# EAGLE design hamilton-thermostat-main (EAGLE 8.1.0)

## Sheet 1 of 4
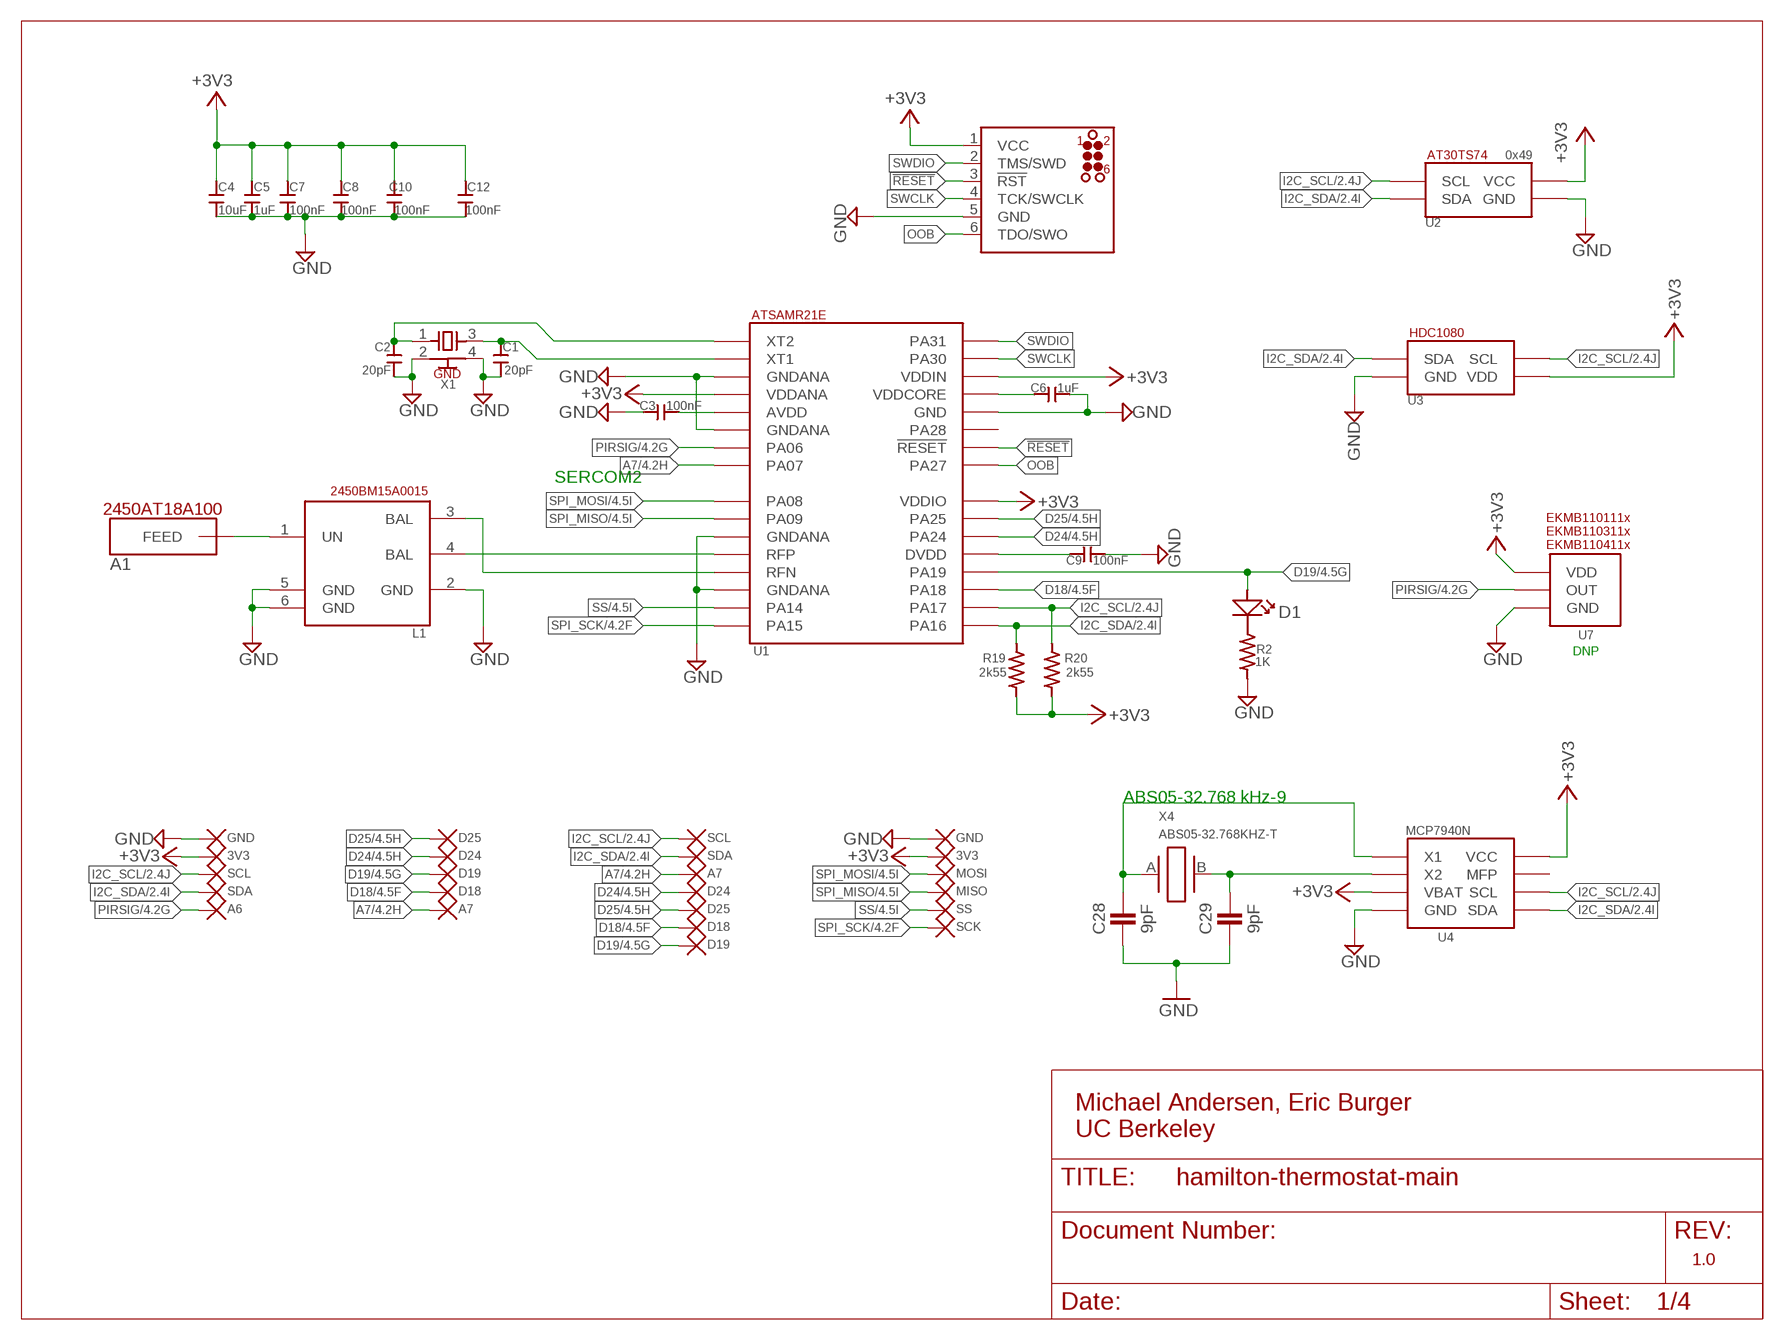
[diagram p0: schematic, sheet 1]

### Parts
A1  JOHANSON_ANTENNA2  [JOHANSON_ANTENNA2]
C1  20pF  0603_CAPACITORSMALL  [S0402]
C2  20pF  0603_CAPACITORSMALL  [S0402]
C3  100nF  0603_CAPACITORSMALL  [S0402]
C4  10uF  0805_CAPACITOR  [0805]
C5  1uF  0603_CAPACITORSMALL  [S0402]
C6  1uF  0603_CAPACITORSMALL  [S0402]
C7  100nF  0603_CAPACITORSMALL  [S0402]
C8  100nF  0603_CAPACITORSMALL  [S0402]
C9  100nF  0603_CAPACITORSMALL  [S0402]
C10  100nF  0603_CAPACITORSMALL  [S0402]
C12  100nF  0603_CAPACITORSMALL  [S0402]
C28  9pF  CAPACITOR  [0402_CAP]
C29  9pF  CAPACITOR  [0402_CAP]
D1  DNP  STATLEDLINE  [LINE_0603]
L1  BALUN_JOHANSON  [BALUN_JOHANSON]
R2  1K  0603_RESISTORSMALL  [S0402]
R19  2k55  0603_RESISTORSMALL  [S0402]
R20  2k55  0603_RESISTORSMALL  [S0402]
TP1  D19  TP  [TPP]
TP2  D18  TP  [TPP]
TP3  A7  TP  [TPP]
TP4  D25  TP  [TPP]
TP6  GND  TP  [TPP]
TP7  SDA  TP  [TPP]
TP8  SCL  TP  [TPP]
TP9  SDA  TP  [TPP]
TP10  SCL  TP  [TPP]
TP11  3V3  TP  [TPP]
TP12  GND  TP  [TPP]
TP13  D24  TP  [TPP]
TP14  D25  TP  [TPP]
TP15  D24  TP  [TPP]
TP16  A6  TP  [TPP]
TP17  D18  TP  [TPP]
TP18  D19  TP  [TPP]
TP19  A7  TP  [TPP]
TP20  MOSI  TP  [TPP]
TP21  MISO  TP  [TPP]
TP22  SS  TP  [TPP]
TP23  SCK  TP  [TPP]
TP24  3V3  TP  [TPP]
U1  SAMR21  [QFN32]
U2  AT30TS74  [4WLCSP]
U3  HDC1080  [WSON_HDC1080]
U4  MCP7940N  [SO8]
U7  PANASONIC_PIR  [PIR]
U$1  JLINK_CONNECTWL  [TC2030-MCP]
X1  XTAL  [XTAL]
X4  ABS05-32.768KHZ-T  [ABS05]

### Nets
!RESET!: U1.26(!RESET!) U$1.3(!RST!)
+3V3: C4.2 C5.P$2 C7.P$1 C8.P$1 C10.P$1 C12.P$1 R19.P$1 R20.P$1 TP11.P$1 TP24.P$1 U1.4(VDDANA) U1.24(VDDIO) U1.30(VDDIN) U2.A1(VCC) U3.5(VDD) U4.3(VBAT) U4.8(VCC) U7.VDD U$1.1(VCC) ; also sheet 2,3,4
A7: TP3.P$1 TP19.P$1 U1.8(PA07) ; also sheet 4
D18: TP2.P$1 TP17.P$1 U1.19(PA18) ; also sheet 4
D19: D1.P(+) TP1.P$1 TP18.P$1 U1.20(PA19) ; also sheet 4
D24: TP13.P$1 TP15.P$1 U1.22(PA24) ; also sheet 4
D25: TP4.P$1 TP14.P$1 U1.23(PA25) ; also sheet 4
GND: C1.P$1 C2.P$1 C3.P$2 C4.1 C5.P$1 C6.P$1 C7.P$2 C8.P$2 C9.P$1 C10.P$2 C12.P$2 C28.2 C29.2 L1.2(GND) L1.5(GND) L1.6(GND) R2.P$1 TP6.P$1 TP12.P$1 U1.3(GNDANA) U1.6(GNDANA) U1.11(GNDANA) U1.14(GNDANA) U1.28(GND) U2.A2(GND) U3.2(GND) U4.4(GND) U7.GND U$1.5(GND) X1.2(GND) X1.4(GND) ; also sheet 2,3,4
I2C_SCL: R20.P$2 TP8.P$1 TP10.P$1 U1.18(PA17) U2.B2(SCL) U3.6(SCL) U4.6(SCL) ; also sheet 2,4
I2C_SDA: R19.P$2 TP7.P$1 TP9.P$1 U1.17(PA16) U2.B1(SDA) U3.1(SDA) U4.5(SDA) ; also sheet 2,4
N$2: L1.3(BAL) U1.13(RFN)
N$3: A1.FEED L1.1(UN)
N$4: C2.P$2 U1.1(XT2) X1.1(X1)
N$5: C6.P$2 U1.29(VDDCORE)
N$6: C3.P$1 U1.5(AVDD)
N$7: C1.P$2 U1.2(XT1) X1.3(X2)
N$10: C9.P$2 U1.21(DVDD)
N$13: L1.4(BAL) U1.12(RFP)
N$14: D1.N(-) R2.P$2
N$46: C28.1 U4.1(X1) X4.A
N$47: C29.1 U4.2(X2) X4.B
OOB: U1.25(PA27) U$1.6(TDO/SWO)
PIRSIG: TP16.P$1 U1.7(PA06) U7.OUT ; also sheet 4
SPI_MISO: TP21.P$1 U1.10(PA09) ; also sheet 4
SPI_MOSI: TP20.P$1 U1.9(PA08) ; also sheet 4
SPI_SCK: TP23.P$1 U1.16(PA15) ; also sheet 4
SS: TP22.P$1 U1.15(PA14) ; also sheet 4
SWCLK: U1.31(PA30) U$1.4(TCK/SWCLK)
SWDIO: U1.32(PA31) U$1.2(TMS/SWD)
Unconnected: U1.27(PA28) U4.7(MFP)

### Notes on the sheet
- 0x49
- X1
- SERCOM2
- DNP
- ABS05-32.768 kHz-9
- Michael Andersen, Eric Burger
  UC Berkeley
- 1.0

## Sheet 2 of 4
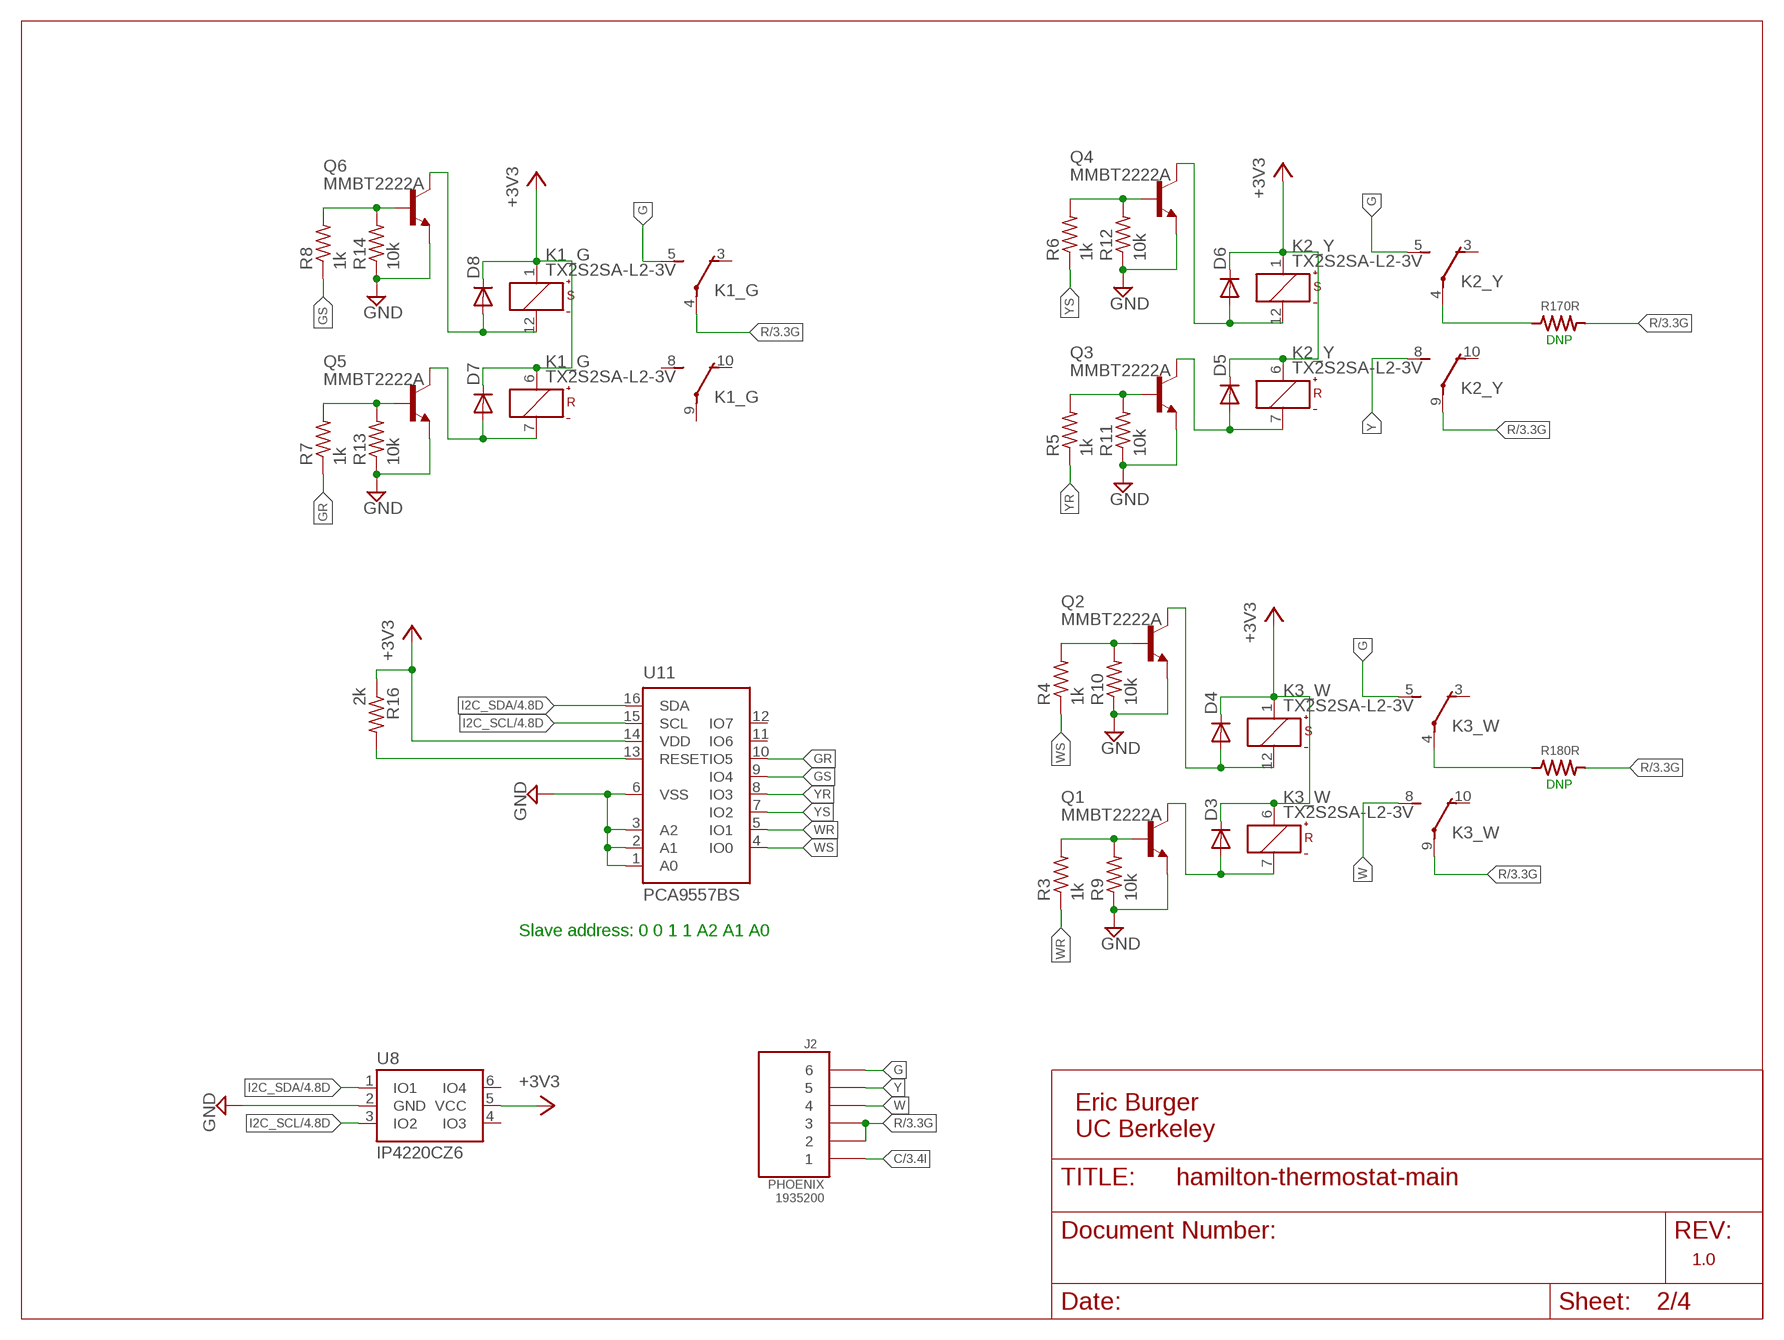
[diagram p1: schematic, sheet 2]

### Parts
D3  DIODE-DO-214AC  [DO-214AC]
D4  DIODE-DO-214AC  [DO-214AC]
D5  DIODE-DO-214AC  [DO-214AC]
D6  DIODE-DO-214AC  [DO-214AC]
D7  DIODE-DO-214AC  [DO-214AC]
D8  DIODE-DO-214AC  [DO-214AC]
J2  PHOENIX6W5MM  [PHOENIX6W5MM]
K1_G  TX2S2SA-L2-3V  [TX2SA-L2]
K2_Y  TX2S2SA-L2-3V  [TX2SA-L2]
K3_W  TX2S2SA-L2-3V  [TX2SA-L2]
Q1  MMBT2222A  TRANSISTOR_NPNMMBT2222A  [SOT23-3]
Q2  MMBT2222A  TRANSISTOR_NPNMMBT2222A  [SOT23-3]
Q3  MMBT2222A  TRANSISTOR_NPNMMBT2222A  [SOT23-3]
Q4  MMBT2222A  TRANSISTOR_NPNMMBT2222A  [SOT23-3]
Q5  MMBT2222A  TRANSISTOR_NPNMMBT2222A  [SOT23-3]
Q6  MMBT2222A  TRANSISTOR_NPNMMBT2222A  [SOT23-3]
R3  1k  R-US_R0402  [R0402]
R4  1k  R-US_R0402  [R0402]
R5  1k  R-US_R0402  [R0402]
R6  1k  R-US_R0402  [R0402]
R7  1k  R-US_R0402  [R0402]
R8  1k  R-US_R0402  [R0402]
R9  10k  R-US_R0402  [R0402]
R10  10k  R-US_R0402  [R0402]
R11  10k  R-US_R0402  [R0402]
R12  10k  R-US_R0402  [R0402]
R13  10k  R-US_R0402  [R0402]
R14  10k  R-US_R0402  [R0402]
R16  2k  R-US_R0402  [R0402]
R17  0R  0603_RESISTORSMALL  [S0402]
R18  0R  0603_RESISTORSMALL  [S0402]
U8  IP4220CZ6  IP4220CZ6SOT-23  [SOT23-6]
U11  PCA9557BS  [HVQFN16_4X4]

### Nets
+3V3: D3.C D4.C D5.C D6.C D7.C D8.C K1_G.1(S:+) K1_G.6(R:+) K2_Y.1(S:+) K2_Y.6(R:+) K3_W.1(S:+) K3_W.6(R:+) R16.1 U8.5(VCC) U11.14(VDD) ; also sheet 1,3,4
C: J2.P$1 ; also sheet 3
G: J2.P$6 K1_G.5(1:S) K2_Y.5(1:S) K3_W.5(1:S)
GND: Q1.2(E) Q2.2(E) Q3.2(E) Q4.2(E) Q5.2(E) Q6.2(E) R9.1 R10.1 R11.1 R12.1 R13.1 R14.1 U8.2(GND) U11.1(A0) U11.2(A1) U11.3(A2) U11.6(VSS) ; also sheet 1,3,4
GR: R7.1 U11.10(IO5)
GS: R8.1 U11.9(IO4)
I2C_SCL: U8.3(IO2) U11.15(SCL) ; also sheet 1,4
I2C_SDA: U8.1(IO1) U11.16(SDA) ; also sheet 1,4
N$1: Q2.1(B) R4.2 R10.2
N$8: R16.2 U11.13(RESET)
N$16: D3.A K3_W.7(R:-) Q1.3(C)
N$18: D4.A K3_W.12(S:-) Q2.3(C)
N$20: Q4.1(B) R6.2 R12.2
N$21: Q1.1(B) R3.2 R9.2
N$22: D5.A K2_Y.7(R:-) Q3.3(C)
N$23: Q3.1(B) R5.2 R11.2
N$24: D6.A K2_Y.12(S:-) Q4.3(C)
N$25: Q6.1(B) R8.2 R14.2
N$26: D7.A K1_G.7(R:-) Q5.3(C)
N$27: Q5.1(B) R7.2 R13.2
N$28: D8.A K1_G.12(S:-) Q6.3(C)
N$50: K2_Y.4(1:P) R17.P$2
N$51: K3_W.4(1:P) R18.P$2
R: J2.P$2 J2.P$3 K1_G.4(1:P) K2_Y.9(2:P) K3_W.9(2:P) R17.P$1 R18.P$1 ; also sheet 3
W: J2.P$4 K3_W.8(2:S)
WR: R3.1 U11.5(IO1)
WS: R4.1 U11.4(IO0)
Y: J2.P$5 K2_Y.8(2:S)
YR: R5.1 U11.8(IO3)
YS: R6.1 U11.7(IO2)
Unconnected: K1_G.3(1:O) K1_G.8(2:S) K1_G.9(2:P) K1_G.10(2:O) K2_Y.3(1:O) K2_Y.10(2:O) K3_W.3(1:O) K3_W.10(2:O) U8.4(IO3) U8.6(IO4) U11.11(IO6) U11.12(IO7)

### Notes on the sheet
- DNP
- DNP
- Slave address: 0 0 1 1 A2 A1 A0
- Eric Burger
  UC Berkeley
- 1.0

## Sheet 3 of 4
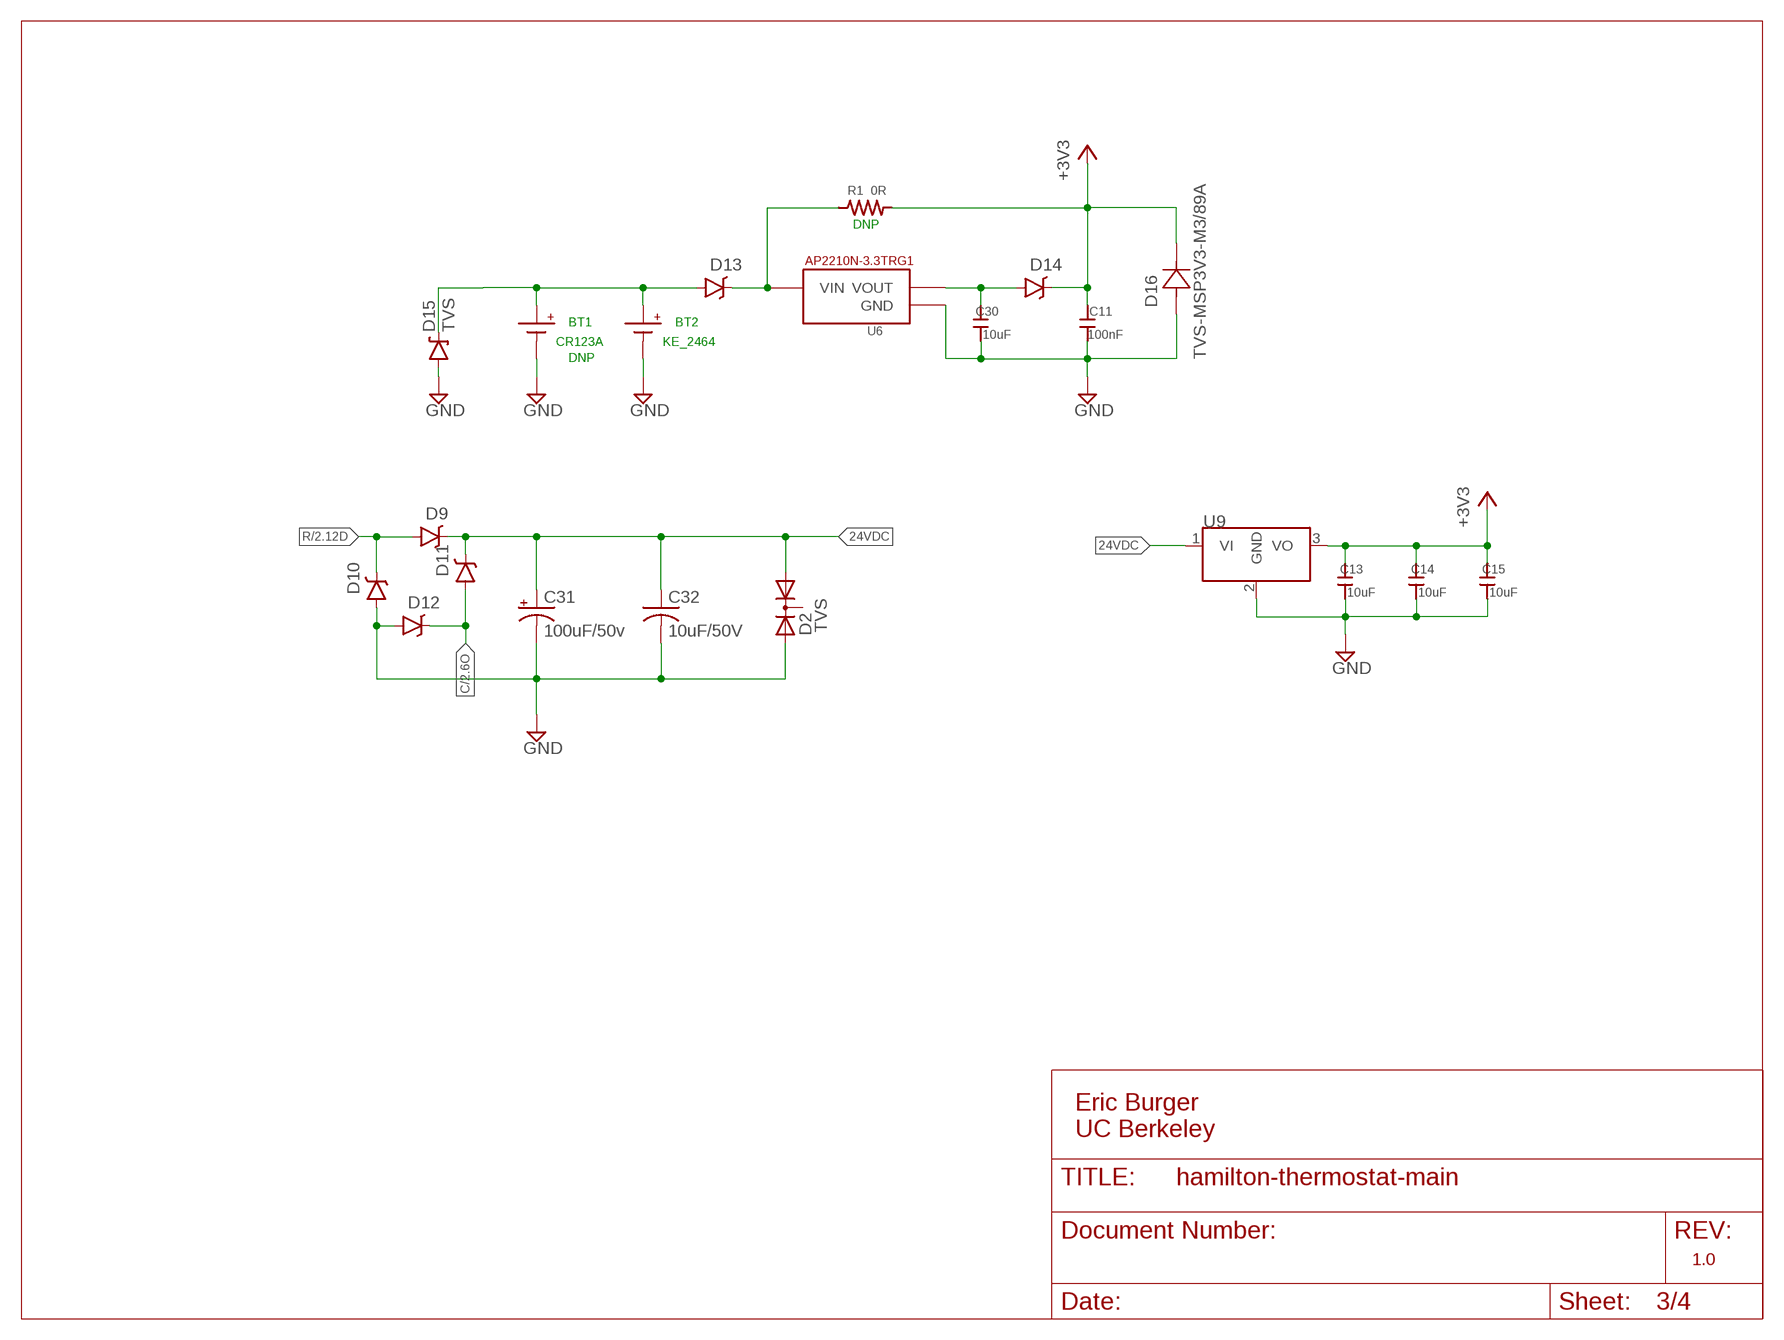
[diagram p2: schematic, sheet 3]

### Parts
BT1  CR123A  [CR123A]
BT2  BATTERY  [KE_2464]
C11  100nF  0603_CAPACITORSMALL  [S0402]
C13  10uF  0805_CAPACITOR  [0805]
C14  10uF  0805_CAPACITOR  [0805]
C15  10uF  0805_CAPACITOR  [0805]
C30  10uF  0805_CAPACITOR  [0805]
C31  100uF/50v  100UF-63V-20%(ELECT)  [NIC_10X10.5_CAP]
C32  10uF/50V  C-USC1206  [C1206]
D2  TVS  DIODE-2AC|CASOT23  [SOT23]
D9  MBRA140  [SMA-DIODE]
D10  MBRA140  [SMA-DIODE]
D11  MBRA140  [SMA-DIODE]
D12  MBRA140  [SMA-DIODE]
D13  MBRA140  DIODE-SCHOTTKY-MBRA140  [SMA-DIODE]
D14  MBRA140  DIODE-SCHOTTKY-MBRA140  [SMA-DIODE]
D15  TVS  DIODE-ZENERSMB  [SMB-DIODE]
D16  TVS-MSP3V3-M3/89A  MSP3V3-M3/89A  [DIODE_MSP3V3]
R1  0R  0603_RESISTORSMALL  [S0402]
U6  SOT23-3VREG  [SOT23]
U9  DCDC_OKI-78SR  [OKI-78SRH]

### Nets
24VDC: C31.+ C32.1 D2.1(A1) D9.C D11.C U9.1(VI)
+3V3: C11.P$1 C13.2 C14.2 C15.2 D14.C D16.1 R1.P$1 U9.3(VO) ; also sheet 1,2,4
C: D11.A D12.C ; also sheet 2
GND: BT1.NEG(-) BT2.NEG(-) C11.P$2 C13.1 C14.1 C15.1 C30.1 C31.- C32.2 D2.2(A2) D10.A D12.A D15.A D16.2 U6.1(GND) U9.2(GND) ; also sheet 1,2,4
N$42: C30.2 D14.A U6.2(VOUT)
N$43: D13.C R1.P$2 U6.3(VIN)
N$44: BT1.POS(+) BT2.POS(+) D13.A D15.C
R: D9.A D10.C ; also sheet 2
Unconnected: D2.3(C)

### Notes on the sheet
- DNP
- BT1 | BT2
- CR123A | KE_2464
- DNP
- Eric Burger
  UC Berkeley
- 1.0

## Sheet 4 of 4
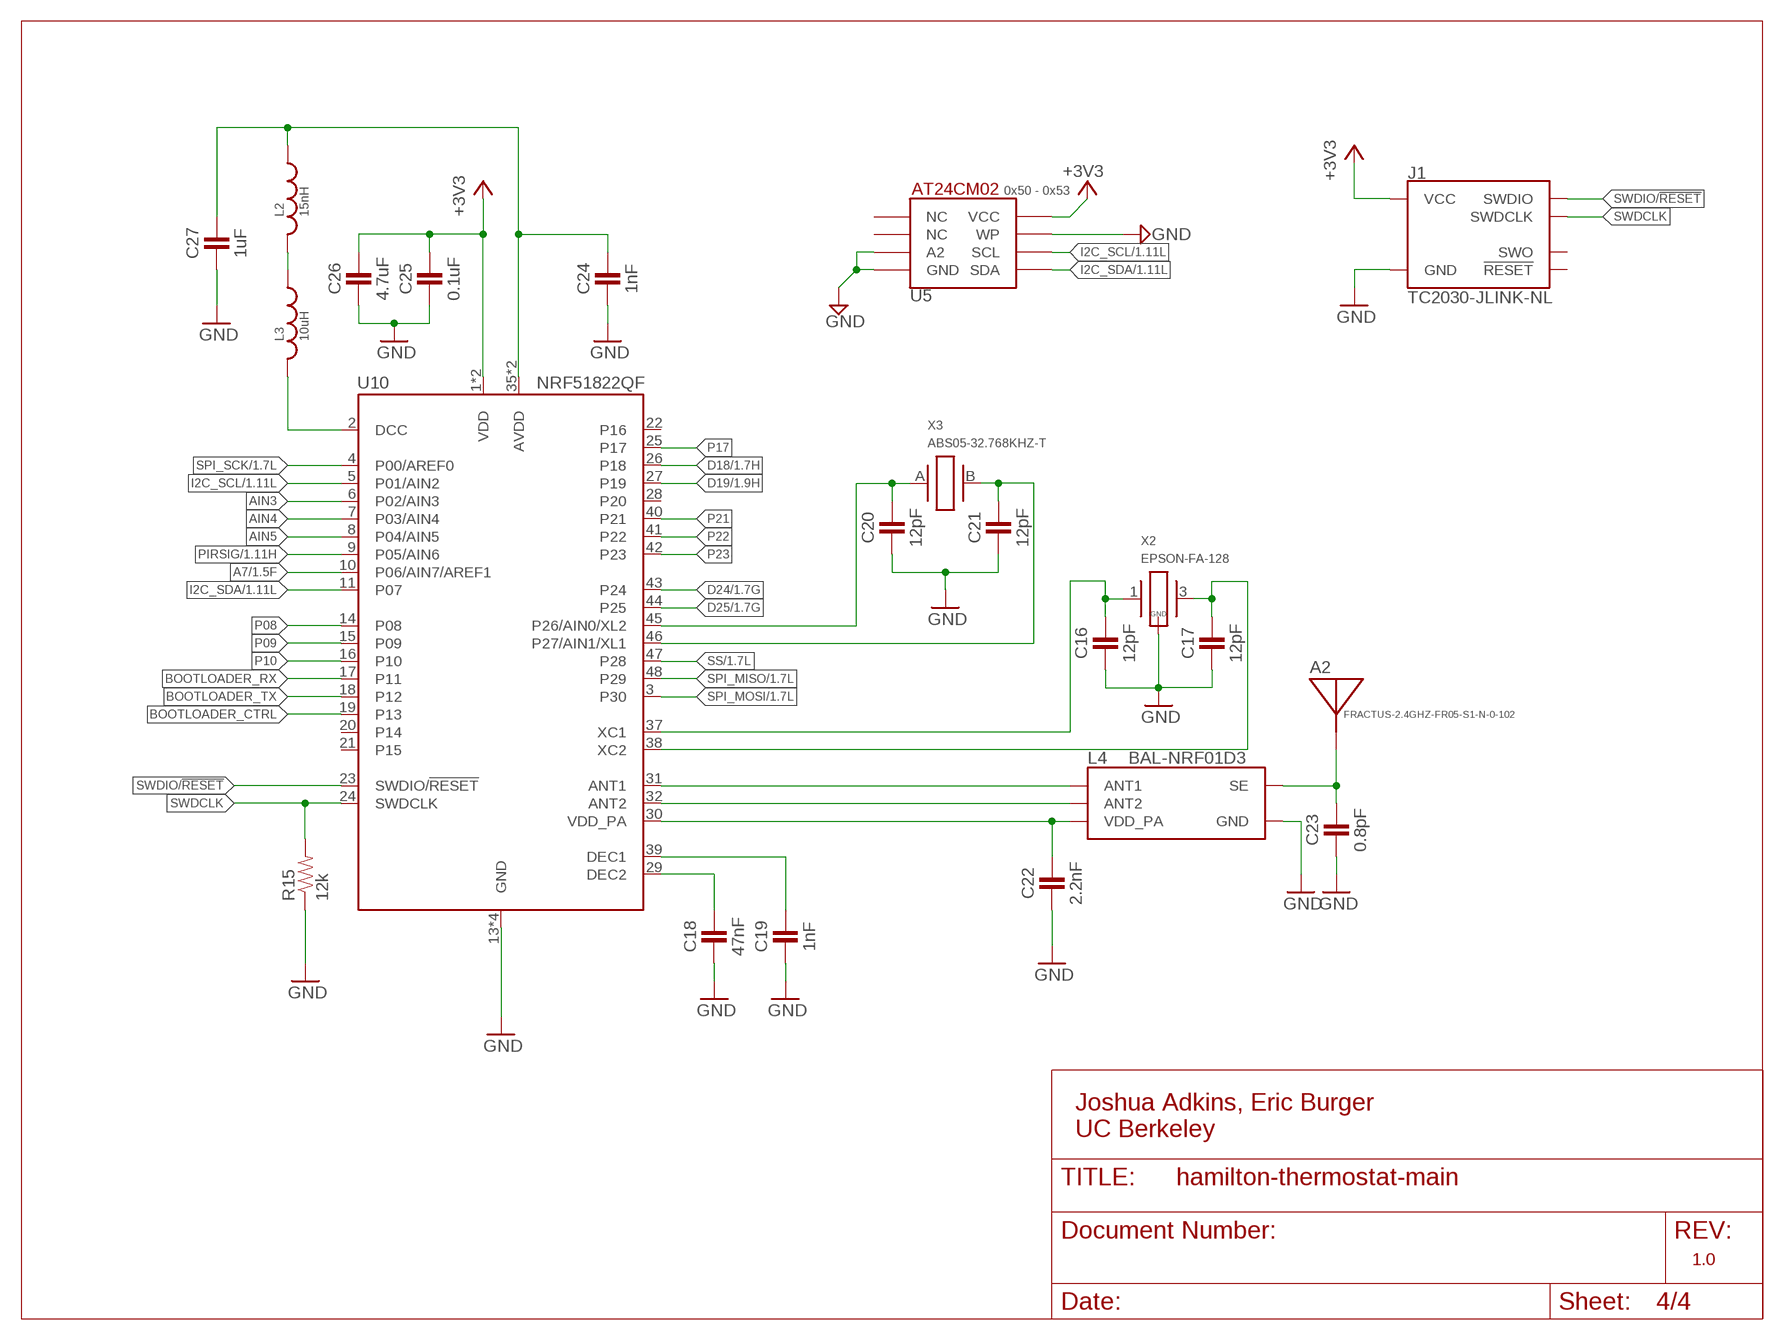
[diagram p3: schematic, sheet 4]

### Parts
A2  FRACTUS-2.4GHZ-FR05-S1-N-0-102  [FRACTUS-ANTENNA-FR05-S1-N-0-102]
C16  12pF  CAPACITOR  [0402_CAP]
C17  12pF  CAPACITOR  [0402_CAP]
C18  47nF  CAPACITOR  [0402_CAP]
C19  1nF  CAPACITOR  [0402_CAP]
C20  12pF  CAPACITOR  [0402_CAP]
C21  12pF  CAPACITOR  [0402_CAP]
C22  2.2nF  CAPACITOR  [0402_CAP]
C23  0.8pF  CAPACITOR  [0402_CAP]
C24  1nF  CAPACITOR  [0402_CAP]
C25  0.1uF  CAPACITOR  [0402_CAP]
C26  4.7uF  CAPACITOR  [0402_CAP]
C27  1uF  CAPACITOR  [0402_CAP]
J1  TC2030-JLINK-NL  [TC2030-IDC-NL]
L2  15nH  INDUCTOR0402  [0402_CAP]
L3  10uH  INDUCTOR0603  [0603_CAP]
L4  BAL-NRF01D3  [BAL-NRF01D3]
R15  12k  RESISTOR0402_RES  [0402_RES]
U5  AT24CM02  [SO8]
U10  NRF51822QF  [QFN-48-6MM]
X2  EPSON-FA-128  [FA-128]
X3  ABS05-32.768KHZ-T  [ABS05]

### Nets
+3V3: C25.1 C26.1 J1.1(VCC) U5.8(VCC) U10.1(VDD) U10.12(VDD) ; also sheet 1,2,3
A7: U10.10(P06/AIN7/AREF1) ; also sheet 1
AIN3: U10.6(P02/AIN3)
AIN4: U10.7(P03/AIN4)
AIN5: U10.8(P04/AIN5)
ANTENNA: A2.1(ANTENNA) C23.1 L4.SE
BOOTLOADER_CTRL: U10.19(P13)
BOOTLOADER_RX: U10.17(P11)
BOOTLOADER_TX: U10.18(P12)
D18: U10.26(P18) ; also sheet 1
D19: U10.27(P19) ; also sheet 1
D24: U10.43(P24) ; also sheet 1
D25: U10.44(P25) ; also sheet 1
GND: C16.2 C17.2 C18.2 C19.2 C20.2 C21.2 C22.2 C23.2 C24.2 C25.2 C26.2 C27.2 J1.5(GND) L4.GND R15.1 U5.3(A2) U5.4(GND) U5.7(WP) U10.13(GND) U10.33(GND) U10.34(GND) U10.GND X2.2(GND) X2.4(GND) ; also sheet 1,2,3
I2C_SCL: U5.6(SCL) U10.5(P01/AIN2) ; also sheet 1,2
I2C_SDA: U5.5(SDA) U10.11(P07) ; also sheet 1,2
N$9: C16.1 U10.37(XC1) X2.1
N$12: C17.1 U10.38(XC2) X2.3
N$29: C18.1 U10.29(DEC2)
N$30: C20.1 U10.45(P26/AIN0/XL2) X3.A
N$31: C21.1 U10.46(P27/AIN1/XL1) X3.B
N$32: C19.1 U10.39(DEC1)
N$33: L4.ANT1 U10.31(ANT1)
N$34: L4.ANT2 U10.32(ANT2)
N$35: C22.1 L4.VCC(VDD_PA) U10.30(VDD_PA)
N$36: C24.1 C27.1 L2.1 U10.35(AVDD) U10.36(AVDD)
N$37: L2.2 L3.1
N$38: L3.2 U10.2(DCC)
P08: U10.14(P08)
P09: U10.15(P09)
P10: U10.16(P10)
P17: U10.25(P17)
P21: U10.40(P21)
P22: U10.41(P22)
P23: U10.42(P23)
PIRSIG: U10.9(P05/AIN6) ; also sheet 1
SPI_MISO: U10.48(P29) ; also sheet 1
SPI_MOSI: U10.3(P30) ; also sheet 1
SPI_SCK: U10.4(P00/AREF0) ; also sheet 1
SS: U10.47(P28) ; also sheet 1
SWDCLK: J1.4(SWDCLK) R15.2 U10.24(SWDCLK)
SWDIO/!RESET: J1.2(SWDIO) U10.23(SWDIO/!RESET)
Unconnected: J1.3(!RESET) J1.6(SWO) U5.1(NC) U5.2(NC) U10.20(P14) U10.21(P15) U10.22(P16) U10.28(P20)

### Notes on the sheet
- 0x50 - 0x53
- Joshua Adkins, Eric Burger
  UC Berkeley
- 1.0

## Library data of the parts
A1 = storm:JOHANSON_ANTENNA2
A2 = chips:FRACTUS-2.4GHZ-FR05-S1-N-0-102: Fractus Compact Reach XtendTM chip antenna is engineered specifically for Bluetooth, WLAN 802.11 b/g/n and other wireless devices operating at the ISM 2.4 GHz band. Compact Reach Xtend combines small form factor size and high performance to improve the functionality of your wireless devices.; RICHARDSON_RFPD: FR05-S1-N-0102B
BT1 = MyLibrary:CR123A
BT2 = MyLibrary:BATTERY
C1-C3 C5-C12 = storm:0603_CAPACITOR
C4 C13-C15 C30 = storm:0805_CAPACITOR
C16-C29 = passives:CAPACITOR: 0402 Capacitor
C31 = SparkFun-Capacitors:100UF-63V-20%(ELECT): CAP-08362 100uF electrolytic SMT 63V 20%; PROD_ID: CAP-08362; VALUE: 100uF
C32 = rcl:C-US: CAPACITOR, American symbol
D1 = storm:STATLED
D2 = diode:DIODE-2AC|CA: Dual DIODE Anode-Cathode|Cathode-Anode
D3-D8 = diode:DIODE-: DIODE
D9-D12 = SparkFun-DiscreteSemi:MBRA140: 40V, 1A Schottky rectifier SMA/DO-214AC package DIO-08053; PROD_ID: DIO-08053
D13 D14 = SparkFun-DiscreteSemi:DIODE-SCHOTTKY: Schottky diodes in SFE's production catalog BAT20J 1A 23V 0.62Vf RB751 120mA 40V 0.37Vf PMEG4005EJ 0.5A 40V 0.42Vf MBRA140 1A 40V 0.5Vf B340A 3A 40V SMA; PROD_ID: DIO-08053
D15 = SparkFun-DiscreteSemi:DIODE-ZENER: Zener Diode Production Part - 8199 3.4V Zener Voltage
D16 = MSP3V3-M3-89A:MSP3V3-M3/89A: Vishay Semiconductor Diodes Division MSP3V3-M3/89A, TVS DIODE 3.3VWM MICROSMP; MANUFACTURER_PART_NUMBER: MSP3V3M389A; VENDOR: Vishay
J1 = connector:TC2030-JLINK
J2 = storm:PHOENIX6W5MM
K1_G K2_Y K3_W = relay:TX2?-L2-*: TX Relay 2 coil latching NAiS 2 AMP. HIGH CAPACITY RELAY WITH HIGH SURGE VOLTAGE & HIGH BREAKDOWN VOLTAGE Source: http://www.mew-europe.com/.. en_ds_61022_0001.pdf TX-S SMALL POLARIZED WITH HIGH SENSITIVITY 50mW Source: http://www.mew-europe.com/.. en_ds_61022_0022.pdf
L1 = storm:BALUN_JOHANSON
L2 L3 = passives:INDUCTOR
L4 = chips:BAL-NRF01D3: 50 ohm nominal input / conjugate match balun to nRF51422-QFAA, nRF24LE1, nRF51822-QFAA/AB, with integrated harmonic filter; DIGIKEY: 497-13637-1-ND; MOUSER: 511-BAL-NRF01D3
Q1-Q6 = SparkFun-DiscreteSemi:TRANSISTOR_NPN: Generic NPN BJT MMBT2222A - TRANS-08049 (SOT-23, 1A 40V) MPSA42 - TRANS-09116 (SOT-23, 500mA 300V) MMBT5088LT1G - TRANS-11160 (SOT-23, 50 mA 30V) BC547 - COM-08928 <http://www.sparkfun.com/products/8928> (TO-92 45V 100mA) (1.Collector 2.Base 3.Emitter) 2N3904 - COM-00521 <http://www.sparkfun.com/products/521> (TO-92 40V 200mA) (1.Emitter 2.Base 3.Collector) P2N2222A - COM-12852 <http://www.sparkfun.com/products/12852> (TO-92 40V 600mA) (1.Collector 2.Base 3.Emitter); PROD_ID: TRANS-08049
R1 R2 R17-R20 = storm:0603_RESISTOR
R3-R14 R16 = adafruit:R-US_: RESISTOR, American symbol
R15 = passives:RESISTOR: Resistor Basic schematic elements and footprints for 0603, 1206, and PTH resistors.
TP1-TP4 TP6-TP24 = storm:TP
U1 = storm:SAMR21
U2 = storm:AT30TS74
U3 = storm:HDC1080
U4 = storm:MCP7940N
U5 = storm:AT24CM02
U6 = storm:SOT23-3VREG
U7 = storm:PANASONIC_PIR
U8 = MyLibrary:IP4220CZ6: IC ESD PROTECT (TVS DIODES) 6TSOP/SOT23-6
U9 = carrilib:DCDC_OKI-78SR: 4.95W DC/DC Converter Manufacturer: Murata Part Number: OKI-78SR-5/1.5-W36H-C OKI-78SR-3.3/1.5-W36H-C
U10 = chips:NRF51822: Multiprotocol Bluetooth® 4.0 low energy/2.4 GHz RF SoC; DIGIKEY: 1490-1032-1-ND; MOUSER: 949-NRF51822-QFAB-R7
U11 = MyLibrary:PCA9557: 8-bit I2C-bus and SMBus I/O port with reset Source: http://www.nxp.com/documents/data_sheet/PCA9557.pdf; MPN: PCA9557BS,118; OC_FARNELL: unknown; OC_NEWARK: 70R6525
U$1 = storm:JLINK_CONNECT
X1 = storm:XTAL
X2 = crystals:EPSON-FA-128: MHz RANGE CRYSTAL UNIT ULTRA MINIATURE SIZE LOW PROFILE SMD http://www.digikey.com/product-search/en?FV=ffec63d1
X3 X4 = crystals:ABS05-32.768KHZ: 32.768kHz Crystal; DIGIKEY: 535-11899-1-ND

## Board
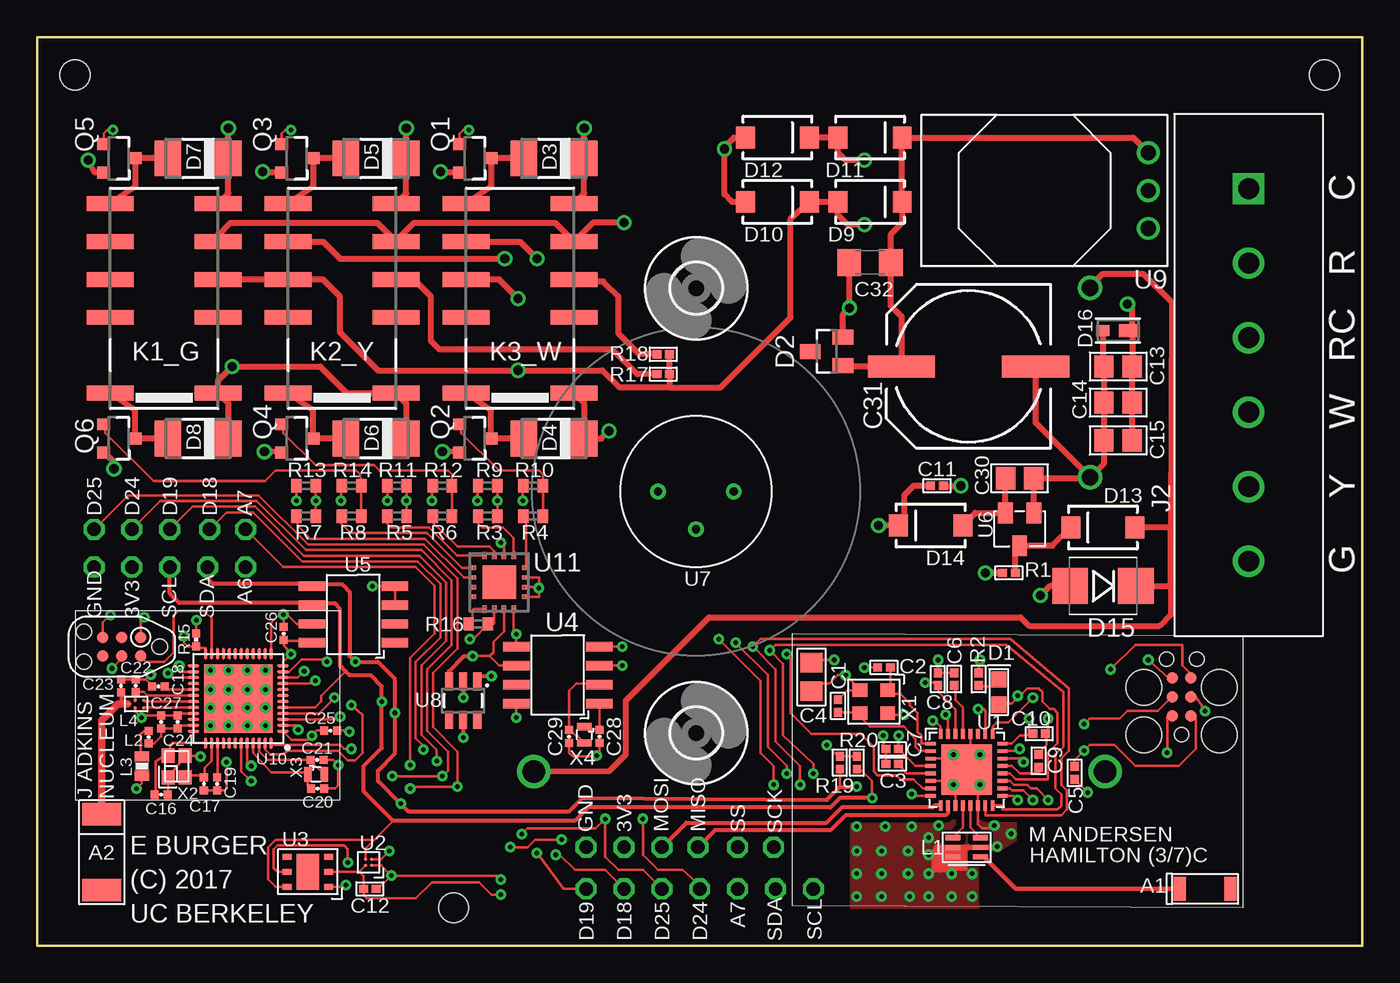
[diagram p4: board, top side]
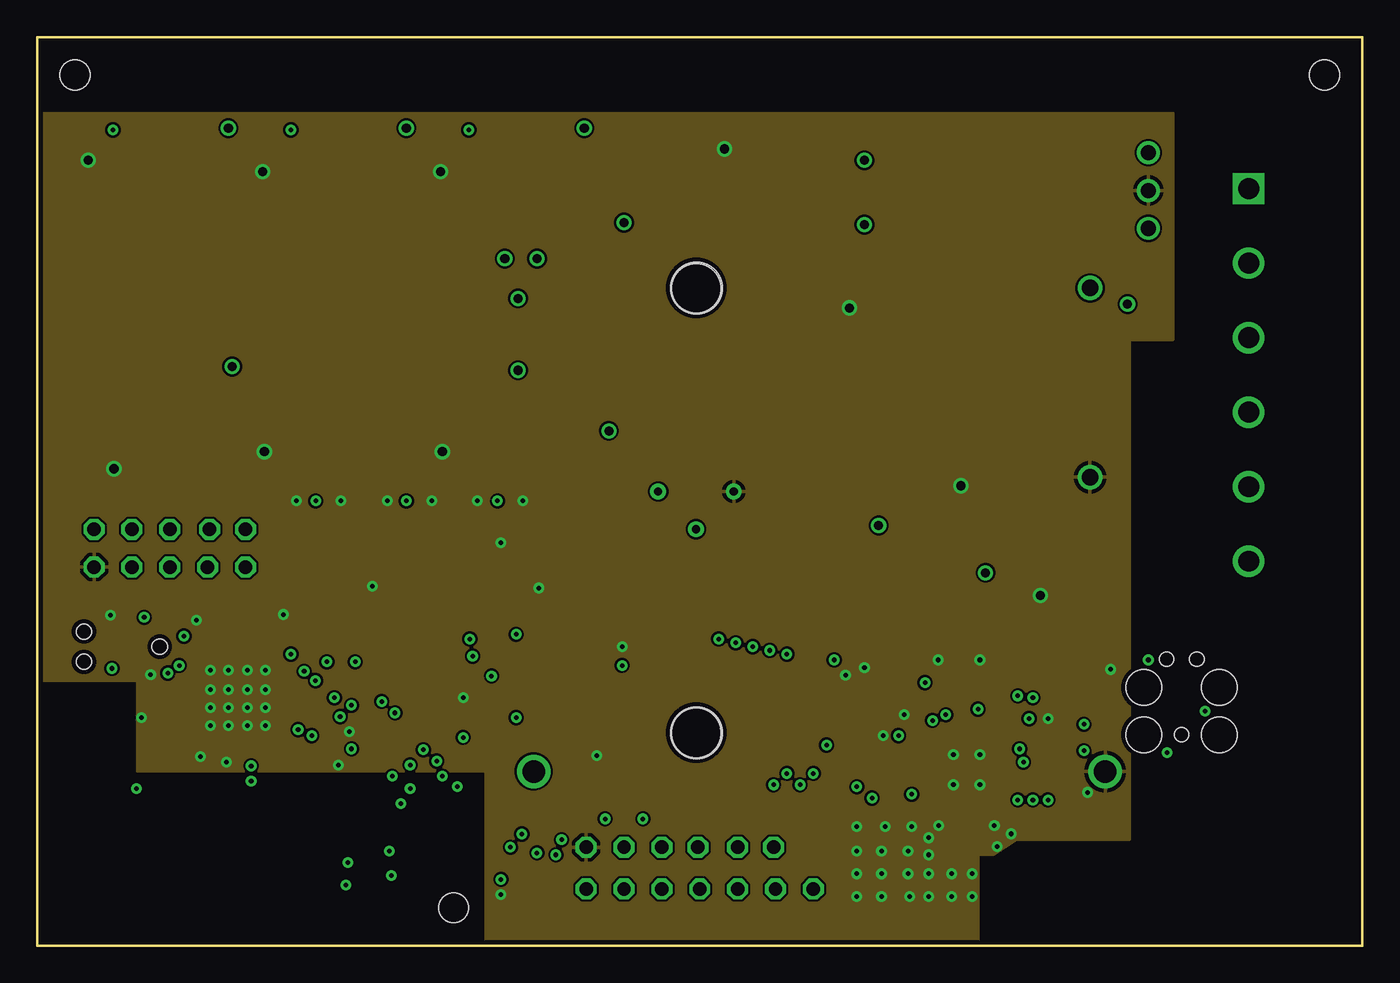
[diagram p5: board, inner layer Route2]
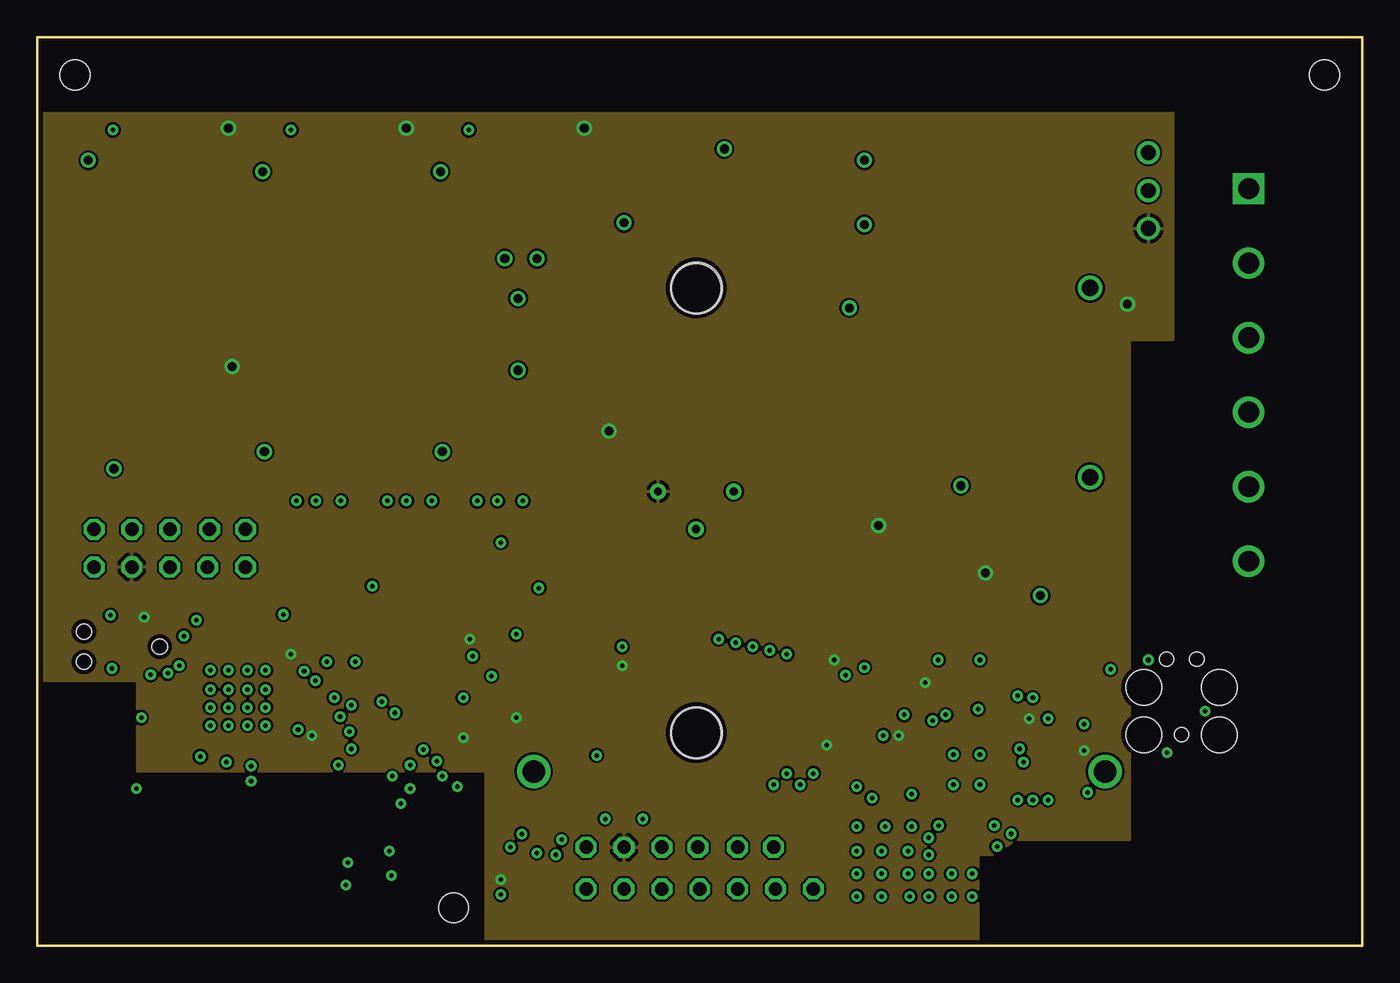
[diagram p6: board, inner layer Route15]
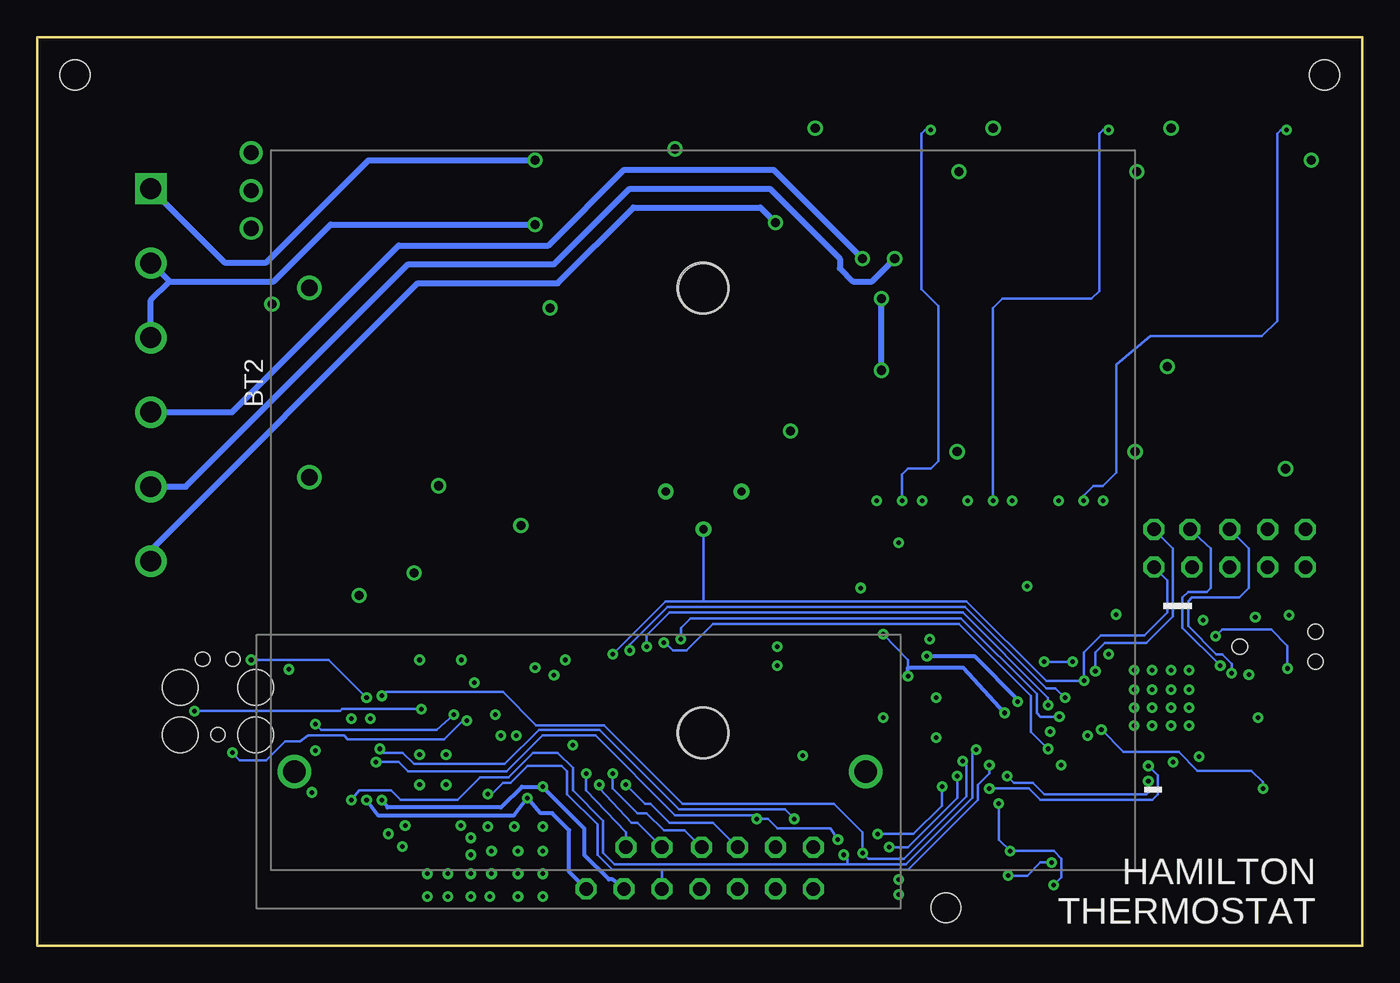
[diagram p7: board, bottom side, seen from below]

Size 88.9 x 60.96 mm. Coordinates in mm from the lower left corner, seen from the top.
Outline: 0,60.96 88.9,60.96 88.9,0 0,0 0,60.96
Copper layers (1*2*15*16): Top 0.035mm / dielectric 1.5mm / Route2 0.035mm / dielectric 0.15mm / Route15 0.035mm / dielectric 0.2mm / Bottom 0.035mm
Design rules "default *": minimum track width 6mil, minimum drill 12mil, track to track 6mil, track to pad 6mil, pad to pad 6mil, via to via 6mil, smd to smd 6mil, copper to edge 12mil, drill to drill 8mil, minimum pad ring 10mil, minimum via ring 8mil, stop-mask expansion 4mil, vias tented up to drill 1mm, thermal gap 10mil
Holes 2 mm at 2.54,58.42 86.36,58.42 27.94,2.54

### Footprints (pad centres in the part's own frame; a part is rotated, then mirrored left to right if it is on the bottom)
JOHANSON_ANTENNA2 = smd 0.8 x 1.6: FEED -1.7,0; NC 1.7,0
FRACTUS-ANTENNA-FR05-S1-N-0-102 = smd 1.5 x 2.6: 1 -2.55,0; 2 2.55,0
CR123A = drill 1.5: NEG -19.07,0; POS 19.27,0
KE_2464 = drill 1.1: NEG 55.4,21.93; POS 55.4,9.23 | hole 3.45: 28.98,9.23; 28.98,39.08
S0402 = smd 0.6 x 0.55: P$1 0,0; P$2 0.85,0
0805 = smd 1.3 x 1.5: 1 -0.95,0; 2 0.95,0
0402_CAP = smd 0.536 x 0.546: 1 -0.433,0; 2 0.433,0
NIC_10X10.5_CAP = smd 4.5 x 1.5: + 4.5,0; - -4.5,0
C1206 = smd 1.6 x 1.8: 1 -1.4,0; 2 1.4,0
LINE_0603 = smd 1.1 x 1: N -0.85,0; P 0.85,0
SOT23 = smd 1 x 1.4: 1 -0.95,-1.1; 2 0.95,-1.1; 3 0,1.1
DO-214AC = smd 1.8 x 2.4: A 2.025,0; C -2.025,0
SMA-DIODE = smd 1.27 x 1.47: A -2.15,0; C 2.15,0
SMB-DIODE = smd 2.4 x 2.4: A 2.2,0; C -2.2,0
DIODE_MSP3V3 = smd 1.397 x 0.889: 1 -0.749,0 | smd 0.864 x 0.762: 2 1.016,0
TC2030-IDC-NL = smd 0.787 x 0.787: 1 -1.27,-0.635; 2 -1.27,0.635; 3 0,-0.635; 4 0,0.635; 5 1.27,-0.635; 6 1.27,0.635 | hole 1.016: -2.54,0; 2.54,1.016; 2.54,-1.016
PHOENIX6W5MM = drill 1.4 square: P$1 0,0 | drill 1.4: P$2 0,-5; P$3 0,-10; P$4 0,-15; P$5 0,-20; P$6 0,-25
TX2SA-L2 = smd 1 x 3.16: 1 -6.35,-3.62; 3 -1.27,-3.62; 4 1.27,-3.62; 5 3.81,-3.62; 6 6.35,-3.62; 7 6.35,3.62; 8 3.81,3.62; 9 1.27,3.62; 10 -1.27,3.62; 12 -6.35,3.62
BALUN_JOHANSON = smd 1 x 0.35: 1 -0.925,0.65; 2 -0.925,0; 3 -0.925,-0.65; 4 0.925,-0.65; 5 0.925,0; 6 0.925,0.65
0603_CAP = smd 0.7 x 1: 1 -0.65,0; 2 0.65,0
BAL-NRF01D3 = smd 0.22 x 0.22: ANT1 -0.517,-0.25; ANT2 -0.517,0.25; GND 0.083,0.25; SE 0.516,0; VCC 0.083,-0.25
SOT23-3 = smd 0.8 x 0.9: 1 -0.95,-1; 2 0.95,-1; 3 0,1.1
R0402 = smd 0.7 x 0.9: 1 -0.65,0; 2 0.65,0
0402_RES = smd 0.536 x 0.546: 1 -0.433,0; 2 0.433,0
TPP = drill 0.9 octagon: P$1 0,0
QFN32 = smd 0.7 x 0.25: 1 -2.4,1.75; 2 -2.4,1.25; 3 -2.4,0.75; 4 -2.4,0.25; 5 -2.4,-0.25; 6 -2.4,-0.75; 7 -2.4,-1.25; 8 -2.4,-1.75; 17 2.4,-1.75; 18 2.4,-1.25; 19 2.4,-0.75; 20 2.4,-0.25; 21 2.4,0.25; 22 2.4,0.75; 23 2.4,1.25; 24 2.4,1.75 | smd 0.25 x 0.7: 9 -1.75,-2.4; 10 -1.25,-2.4; 11 -0.75,-2.4; 12 -0.25,-2.4; 13 0.25,-2.4; 14 0.75,-2.4; 15 1.25,-2.4; 16 1.75,-2.4; 25 1.75,2.4; 26 1.25,2.4; 27 0.75,2.4; 28 0.25,2.4; 29 -0.25,2.4; 30 -0.75,2.4; 31 -1.25,2.4; 32 -1.75,2.4 | smd 3.4 x 3.4: PAD 0,0
4WLCSP = smd 0.235 x 0.235: A1 -0.2,0.2; A2 0.2,0.2; B1 -0.2,-0.2; B2 0.2,-0.2
WSON_HDC1080 = smd 0.6 x 0.4: 1 -1.4,1; 2 -1.4,0; 3 -1.4,-1; 4 1.4,-1; 5 1.4,0; 6 1.4,1 | smd 1.5 x 2.4: P$7 0,0
SO8 = smd 1.778 x 0.635: 1 -2.54,2.54; 2 -2.54,1.27; 3 -2.54,0; 4 -2.54,-1.27; 5 3.048,-1.27; 6 3.048,0; 7 3.048,1.27; 8 3.048,2.54
PIR = drill 0.55: GND 0,0; OUT 2.54,-2.54; VDD 0,-5.08
SOT23-6 = smd 0.55 x 1.2: 1 0.95,1.3; 2 0,1.3; 3 -0.95,1.3; 4 -0.95,-1.3; 5 0,-1.3; 6 0.95,-1.3
OKI-78SRH = drill 1.016: 1 2.54,0; 2 0,0; 3 -2.54,0
QFN-48-6MM = smd 0.8 x 0.203: 1 -3,2.2; 2 -3,1.8; 3 -3,1.4; 4 -3,1; 5 -3,0.6; 6 -3,0.2; 7 -3,-0.2; 8 -3,-0.6; 9 -3,-1; 10 -3,-1.4; 11 -3,-1.8; 12 -3,-2.2; 25 3,-2.2; 26 3,-1.8; 27 3,-1.4; 28 3,-1; 29 3,-0.6; 30 3,-0.2; 31 3,0.2; 32 3,0.6; 33 3,1; 34 3,1.4; 35 3,1.8; 36 3,2.2 | smd 0.203 x 0.8: 13 -2.2,-3; 14 -1.8,-3; 15 -1.4,-3; 16 -1,-3; 17 -0.6,-3; 18 -0.2,-3; 19 0.2,-3; 20 0.6,-3; 21 1,-3; 22 1.4,-3; 23 1.8,-3; 24 2.2,-3; 37 2.2,3; 38 1.8,3; 39 1.4,3; 40 1,3; 41 0.6,3; 42 0.2,3; 43 -0.2,3; 44 -0.6,3; 45 -1,3; 46 -1.4,3; 47 -1.8,3; 48 -2.2,3 | smd 4.6 x 4.6: GND 0,0
HVQFN16_4X4 = smd 0.5 x 0.3: 1 -1.8,0.975; 2 -1.8,0.325; 3 -1.8,-0.325; 4 -1.8,-0.975; 9 1.8,-0.975; 10 1.8,-0.325; 11 1.8,0.325; 12 1.8,0.975 | smd 0.3 x 0.5: 5 -0.975,-1.8; 6 -0.325,-1.8; 7 0.325,-1.8; 8 0.975,-1.8; 13 0.975,1.8; 14 0.325,1.8; 15 -0.325,1.8; 16 -0.975,1.8 | smd 2.25 x 2.25: TH 0,0
TC2030-MCP = smd 0.787 x 0.787: 1 1.27,-0.635; 2 1.27,0.635; 3 2.54,-0.635; 4 2.54,0.635; 5 3.81,-0.635; 6 3.81,0.635 | hole 0.95: 0,0; 5.08,-1.016; 5.08,1.016 | hole 2.375: 0,2.54; 0,-2.54; 3.175,-2.54; 3.175,2.54
3,3 = hole 3.3: 0,0
XTAL = smd 1 x 0.9: 1 -0.925,-0.775; 2 0.925,-0.775; 3 0.925,0.775; 4 -0.925,0.775
FA-128 = smd 0.95 x 0.85: 1 -0.725,-0.575; 2 0.725,-0.575; 3 0.725,0.575; 4 -0.725,0.575
ABS05 = smd 0.5 x 1: A -0.55,0; B 0.55,0

### Placement (x,y rotation side)
A1  78.36,3.81 0 top
A2  4.32,6.27 270 top
BT1  52.58,11.68 0 bottom
BT2  15.24,53.37 180 bottom
C1  53.72,16.51 270 top
C2  56.39,18.67 0 top
C3  57.78,12.19 180 top
C4  51.94,18.03 90 top
C5  69.6,11.18 90 top
C6  61.52,18.31 270 top
C7  57.78,13.21 180 top
C8  60.42,17.47 90 top
C9  67.18,12.83 270 top
C10  66.8,14.22 0 top
C11  59.94,30.86 0 top
C12  22.73,3.81 180 top
C13  72.52,38.86 0 top
C14  72.52,36.45 0 top
C15  72.52,33.91 0 top
C16  8.31,10.14 0 top
C17  11.19,10.86 270 top
C18  8.13,17.39 180 top
C19  12.06,10.85 270 top
C20  18.81,10.54 0 top
C21  18.77,12.47 0 top
C22  6.61,17.45 90 top
C23  5.62,17.44 90 top
C24  9.42,15.02 90 top
C25  19.67,14.43 0 top
C26  16.53,20.94 90 top
C27  8.32,15.01 90 top
C28  37.72,14.03 270 top
C29  35.69,14.03 270 top
C30  65.91,31.37 180 top
C31  62.48,38.86 180 top
C32  55.88,45.85 180 top
D1  64.52,17.02 270 top
D2  52.96,39.88 90 top
D3  34.67,52.83 180 top
D4  34.67,34.04 180 top
D5  22.73,52.83 180 top
D6  22.73,34.04 180 top
D7  10.79,52.83 180 top
D8  10.79,34.04 180 top
D9  55.88,49.91 0 top
D10  49.66,49.91 0 top
D11  55.88,54.23 0 top
D12  49.66,54.23 0 top
D13  71.5,28.07 180 top
D14  59.94,28.19 180 top
D15  71.5,24.13 180 top
D16  72.52,41.27 180 top
J1  5.67,20.06 180 top
J2  81.28,50.8 0 top
K1_G  8.51,43.43 90 top
K2_Y  20.45,43.43 90 top
K3_W  32.39,43.43 90 top
L1  62.36,6.6 180 top
L2  7.48,14 90 top
L3  7.02,12.05 270 top
L4  6.64,16.22 180 top
Q1  29.34,52.83 270 top
Q2  29.34,34.04 270 top
Q3  17.4,52.83 270 top
Q4  17.4,34.04 270 top
Q5  5.46,52.83 270 top
Q6  5.46,34.04 270 top
R1  64.77,25.02 0 top
R2  63.16,18.31 270 top
R3  30.23,28.83 0 top
R4  33.27,28.83 0 top
R5  24.13,28.83 0 top
R6  27.18,28.83 0 top
R7  18.03,28.83 0 top
R8  21.08,28.83 0 top
R9  30.23,30.86 0 top
R10  33.27,30.86 0 top
R11  24.13,30.86 0 top
R12  27.18,30.86 0 top
R13  18.03,30.86 0 top
R14  21.08,30.86 0 top
R15  10.67,20.53 270 top
R16  29.59,21.59 180 top
R17  42.42,38.35 180 top
R18  42.42,39.69 180 top
R19  53.85,12.7 270 top
R20  54.99,12.7 270 top
TP1  36.83,3.81 90 top
TP2  39.37,3.81 90 top
TP3  46.99,3.81 90 top
TP4  41.91,3.81 90 top
TP6  36.83,6.6 90 top
TP7  49.53,3.81 90 top
TP8  52.07,3.81 90 top
TP9  11.43,25.4 0 top
TP10  8.89,25.4 0 top
TP11  6.35,25.4 0 top
TP12  3.81,25.4 0 top
TP13  44.45,3.81 0 top
TP14  3.81,27.94 90 top
TP15  6.35,27.94 90 top
TP16  13.97,25.4 0 top
TP17  11.56,27.94 0 top
TP18  8.89,27.94 0 top
TP19  13.97,27.94 0 top
TP20  41.91,6.6 90 top
TP21  44.32,6.6 90 top
TP22  46.99,6.6 90 top
TP23  49.4,6.6 90 top
TP24  39.37,6.6 90 top
U1  62.36,11.81 0 top
U2  22.23,5.59 180 top
U3  18.16,4.95 180 top
U4  35.18,18.8 180 top
U5  21.46,22.86 180 top
U6  65.91,27.94 180 top
U7  46.74,30.48 270 top
U8  28.57,16.45 0 top
U9  74.55,50.67 90 top
U10  13.49,16.59 180 top
U11  30.99,24.38 180 top
U$1  76.78,14.15 90 top
U$3  [3,3]  44.22,44.12 180 top
U$4  [3,3]  44.22,14.27 180 top
X1  56.13,16.38 180 top
X2  9.35,12.03 270 top
X3  18.71,11.49 0 top
X4  36.7,14.16 270 top

### Tracks (layer width: path | path; a pad name or v marks a point on that pad's centre or on a via)
24VDC
  Top 0.406: U9.1 73.53,54.23 D11.C D9.C 58.04,50.03 58.04,48.51 57.28,47.76 C32.1 57.28,46.35 57.28,42.93 57.98,42.22 C31.+ 54.12,38.86 D2.1
!RESET!  (via drill 0.3)
  Top 0.152: U1.26 63.61,15.77 63.5,15.88 v63.12,15.88 | v78.36,15.75 77.6,16.89 77.47,17.02 U$1.3
  Bottom 0.152: v63.12,15.88 68.45,15.88 68.58,15.75 v78.36,15.75
+3V3  (via drill 0.3, 0.61)
  Top 0.152: U1.4 58.93,12.06 C7.P$1 v57.78,14.1 | U1.24 64.78,13.59 65.41,13.59 65.91,14.1 66.41,14.1 66.52,14.21 66.53,14.21 C10.P$1 66.55,14.24 v66.55,15.24 | 61.59,14.1 U1.30 61.61,15.86 60.45,17.02 60.45,17.44 | C5.P$2 69.6,12.45 v70.23,13.08 70.61,13.46 72.26,13.46 73.66,12.07 76.58,12.07 77.72,13.21 77.72,15.24 77.41,15.55 U$1.1 | 60.45,17.44 C8.P$1 | C4.2 52,18.98 52.2,19.18 v53.47,19.18 | 60.45,17.44 60.23,17.44 60.33,17.65 v59.56,17.65 | 19.21,14.49 19.3,14.46 C25.1 18.75,14.43 v18.41,14.1 18.14,13.82 17.08,13.82 U10.1 | 16.7,18.79 U10.12 16.49,19.03 v17.02,19.56 16.53,20.17 C26.1 16.6,20.45 17.65,20.45 U5.8 | 30.99,4.57 v31.11,4.45 30.86,4.7 v23.75,4.7 | U11.14 30.66,21.63 R16.1 29.29,20.59 v29.02,20.57 | R20.P$1 R19.P$1 53.72,12.7 v52.96,13.46 | U3.5 16.13,4.95 15.88,5.21 15.88,6.48 16.13,6.73 20.57,6.73 20.83,6.48 v20.83,5.59 | C12.P$1 22.86,3.81 v23.75,4.7 | U2.A1 23.06,5.39 v23.75,4.7 | U4.8 v32.13,15.3 | U4.3 v39.24,18.8 | J1.1 6.94,21.8 v7.18,22.03
  Top 0.254: U8.5 v28.57,13.97
  Top 0.406: K3_W.6 36.7,50.48 D3.C 36.7,54.73 v36.7,54.86 | K2_Y.6 24.76,50.48 D5.C 24.76,54.73 v24.77,54.86 | K1_G.6 12.82,50.48 D7.C v12.82,54.86 v12.83,54.86 | D8.C 12.82,36.39 K1_G.1 12.13,37.91 v13.08,38.86 18.99,38.86 20.76,37.08 K2_Y.1 24.76,36.39 D6.C | K3_W.1 36.7,36.39 D4.C 37.84,34.03 v38.35,34.54 | R1.P$1 v63.63,25.02 | v56.45,28.19 D14.C 58.17,28.2 58.17,30.23 58.8,30.86 C11.P$1 | C15.2 C14.2 C13.2 73.47,41.15 | 73.47,41.15 73.47,42.74 v73.15,43.05 | D16.1 73.34,41.27 73.47,41.15
  Bottom 0.152: v20.83,5.59 21.59,5.59 22.48,4.7 v23.75,4.7
  pour Route15: 0,55.88 76.2,55.88 76.2,40.64 73.28,40.64 73.28,7.11 65.66,7.11 64.14,6.1 63.12,6.1 63.12,0 30.1,0 30.1,11.68 6.73,11.68 6.73,17.78 0,17.78
A7  (via drill 0.3)
  Top 0.152: 59.93,10.03 59.69,10.03 59.69,10.06 U1.8 58.77,10.06 v58.67,10.16 | TP19.P$1 16.51,25.4 25.4,25.4 26.67,24.13 26.67,20.95 25.02,19.3 v25.02,12.13 | U10.10 17.48,17.99 v17.91,18.41
  Bottom 0.152: 46.99,5.08 50.29,5.08 51.31,6.1 51.31,8.13 53.34,10.16 53.34,11.68 53.72,12.07 56.01,12.07 57.15,10.92 57.66,10.92 58.42,10.16 v58.67,10.16 | TP3.P$1 46.99,5.08 | v17.91,18.41 17.91,19.68 17.27,20.32 14.48,20.32 12.7,22.1 12.7,26.67 TP19.P$1 | v25.02,12.13 25.02,11.56 25.78,10.8 25.78,9.78 30.48,5.08 46.99,5.08
ANTENNA
  Top 0.254: L4.SE 6.09,16.26 6.07,16.22 | C23.1 5.62,16.22
  Top 0.5: A2.1 4.32,14.22 4.32,15.11 5.43,16.22 5.62,16.22 6.07,16.22
C  (via drill 0.61)
  Top 0.406: D12.C D11.A 53.72,53.21 54.23,52.7 v55.5,52.7
  Bottom 0.406: v55.5,52.7 66.67,52.7 73.53,45.85 76.33,45.85 J2.P$1
D18  (via drill 0.3)
  Top 0.152: v67.82,9.78 67.06,10.54 66.67,10.54 66.42,10.8 65.53,10.8 65.27,11.06 U1.19 | TP17.P$1 12.7,29.08 14.48,29.08 17.78,25.78 25.53,25.78 27.05,24.26 27.05,20.7 25.4,19.05 25.4,13.91 25.91,13.4 v25.91,13.14 | U10.26 9.75,18.39 v9.53,18.8 | v34.8,6.1 35.05,6.1 36.07,5.08 38.1,5.08 TP2.P$1
  Bottom 0.152: v67.82,9.78 67.31,10.41 65.15,10.41 64.52,9.78 60.71,9.78 59.18,11.3 57.28,11.3 55.63,12.95 53.97,12.95 52.96,11.94 52.96,10.41 50.93,8.38 50.93,6.22 50.17,5.46 34.54,5.46 | v9.53,18.8 12.06,21.34 12.06,23.37 11.68,23.75 10.41,23.75 10.16,24 10.16,26.67 TP17.P$1 | 34.54,5.46 34.54,5.84 v34.8,6.1 | v25.91,13.14 26.16,12.89 26.16,9.91 30.61,5.46 34.54,5.46
D19  (via drill 0.3)
  Top 0.152: U10.27 9.06,17.99 v8.76,18.29 | 65.85,16.7 66.42,17.27 67.18,17.27 67.44,17.02 67.44,16.38 67.94,15.88 68.2,15.88 68.45,15.62 68.45,13.59 67.82,12.95 67.82,11.18 65.66,11.18 65.27,11.56 U1.20 | 65.85,16.7 65.41,16.26 64.6,16.26 D1.P | 65.85,16.7 v65.79,16.76 | TP18.P$1 10.41,29.46 14.61,29.46 17.91,26.16 25.65,26.16 27.43,24.38 27.43,20.45 25.78,18.8 25.78,14.16 26.8,13.14 v26.8,12.38 | TP1.P$1 35.31,3.81 v33.53,6.22
  Bottom 0.152: v8.76,18.29 8.76,18.92 9.4,19.56 9.78,19.56 11.68,21.46 11.68,23.11 11.43,23.37 8.26,23.37 7.62,24 7.62,26.67 TP18.P$1 | v65.79,16.76 65.53,17.02 57.66,17.02 55.44,14.8 50.86,14.8 45.59,9.53 35.43,9.53 33.53,7.62 v33.53,6.22 33.15,5.84 30.73,5.84 26.54,10.03 26.54,12.13 v26.8,12.38
D24  (via drill 0.3)
  Top 0.152: v66.17,12.32 65.92,12.56 U1.22 | TP15.P$1 8.26,29.84 14.73,29.84 18.03,26.54 25.78,26.54 27.81,24.51 27.81,20.19 26.16,18.54 26.16,14.41 27.56,13.02 27.56,11.75 v27.18,11.37 v23.81,11.37 | U10.43 13.69,11.71 v14.35,11.05 | TP13.P$1 44.45,4.06 43.31,5.08 41.66,5.08 40.64,6.1 v40.64,8.51 | v35.18,7.11 33.4,7.11 32.89,6.6 v31.75,6.6
  Bottom 0.152: v66.17,12.32 64.64,12.32 64.01,11.68 57.4,11.68 54.99,14.1 51.44,14.1 46.1,8.76 40.89,8.76 v40.64,8.51 39.88,8.51 39.24,7.87 35.69,7.87 v35.18,7.11 | v14.35,11.05 14.35,10.29 14.48,10.16 21.34,10.16 22.1,10.92 23.37,10.92 v23.81,11.37 | 31.11,6.6 v31.75,6.6 30.48,6.6 27.18,9.91 v27.18,11.37
D25  (via drill 0.3)
  Top 0.152: TP14.P$1 6.1,30.23 14.86,30.23 18.16,26.92 25.91,26.92 28.19,24.64 28.19,19.94 26.54,18.29 26.54,14.67 28.19,13.02 v28.19,10.67 25.15,10.67 v25.02,10.54 | U1.23 65.77,13.06 v65.91,13.21 | U10.44 14.09,12.32 v14.35,12.07 | TP4.P$1 40.64,5.08 38.99,5.08 38.1,5.97 v38.1,8.51 37.47,7.87 32.89,7.87 v32.51,7.49
  Bottom 0.152: v65.91,13.21 65.66,12.95 64.39,12.95 63.63,12.19 57.53,12.19 55.25,14.48 51.18,14.48 45.85,9.14 38.73,9.14 v38.1,8.51 | v32.51,7.49 30.1,7.49 28.19,9.4 v28.19,10.67 | v14.35,12.07 13.72,11.43 13.72,10.16 14.1,9.78 21.59,9.78 22.35,10.54 v25.02,10.54
G  (via drill 0.61)
  Top 0.406: K1_G.5 12.13,47.69 12.95,48.51 22.8,48.51 K2_Y.5 24.07,47.31 25.27,48.51 34.73,48.51 K3_W.5 37.27,48.51 v39.37,48.51
  Bottom 0.406: J2.P$6 81.15,26.67 63.37,44.45 53.97,44.45 48.89,49.53 40.39,49.53 v39.37,48.51
GND  (via drill 0.3, 0.61)
  Top 0.152: 64.26,7.87 63.37,7.87 63.11,8.14 U1.14 63.11,10.28 63.12,10.29 | X1.4 57.28,15.61 | 57.28,15.61 57.39,15.61 57.4,15.62 | C2.P$1 v55.5,18.67 | v58.17,15.49 57.4,15.49 57.28,15.62 57.28,15.61 | U1.6 60.22,11.05 61.34,11.05 v61.47,10.8 61.59,10.67 61.59,9.41 U1.11 | U1.3 59.97,12.57 60.96,12.57 v61.47,12.83 | U1.28 62.61,14.08 62.61,12.95 62.99,12.57 v63.25,12.83 | R2.P$1 63.16,19.09 v63.25,19.18 | C6.P$1 C8.P$2 60.42,19.15 v60.45,19.18 | C1.P$1 54.36,17.14 55.2,17.14 X1.2 55.21,17.18 v54.23,18.16 53.72,18.16 53.15,17.59 51.88,17.59 C4.1 | U$1.5 77.29,18.34 76.83,18.8 76.83,20.19 73.66,20.19 v72.01,18.54 | 17.46,30.86 R13.1 v17.4,29.84 | R14.1 20.38,30.48 v20.38,29.84 | R11.1 23.5,30.48 v23.5,29.84 | R12.1 26.48,30.48 v26.48,29.84 | R9.1 29.53,30.48 v29.53,29.84 | R10.1 32.58,30.48 v32.58,29.84 | C9.P$1 67.18,12.95 67.69,13.46 67.69,14.18 C10.P$2 67.82,14.24 v67.82,15.24 | v10.94,12.68 10.88,12.75 X2.4 X2.2 8.78,10.37 C16.2 | 7.29,17.88 C22.2 6.27,17.88 C23.2 | 7.29,17.88 v7.61,18.18 | C25.2 20.87,14.44 v20.95,14.35 | 19.25,10.43 C20.2 19.99,10.54 20.19,10.75 v20.19,12.13 19.85,12.47 C21.2 | U10.34 U10.33 9.56,15.59 C24.2 8.52,15.45 C27.2 7.13,15.45 v6.99,15.3 6.56,15.73 L4.GND | C18.2 7.64,17.54 7.29,17.88 | 4.4,20.52 J1.5 4.4,21.68 4.9,22.17 v4.91,22.17 | v56.77,14.1 56.77,13.08 56.75,13.19 C7.P$2 C3.P$2 | C5.P$1 v70.48,10.29 | R15.1 10.67,21.78 v10.67,21.84 | 16.37,21.46 C26.2 16.53,22.2 v16.51,22.22 | U10.13 15.69,21.66 16.26,22.22 v16.51,22.22 | U5.7 17.4,21.59 16.76,22.22 v16.51,22.22 | U11.6 31.31,26.85 v31.11,27.05 | C17.2 12.18,10.43 C19.2 12.58,10.42 12.7,10.54 v12.7,12.32
  Top 0.152: U5.3 U5.4 v22.48,24.13 | C29.2 35.69,12.95 35.94,12.7 37.47,12.7 v37.53,12.76 37.72,13.02 C28.2 | 21.59,4.95 U3.2 | 21.59,4.95 U2.A2 | 21.59,4.95 21.88,4.66 C12.P$2 21.88,3.39 22.1,3.17 25.4,3.17 26.48,4.25 29.65,4.25 30.48,3.43 v31.11,3.43 | U11.1 33.66,23.41 v33.66,24 | v33.66,24 33.66,24.71 U11.3 | U11.2 33.66,24.06 v33.66,24 | U4.4 v39.24,20.07
  Top 0.254: U8.2 v28.57,16.64
  Top 0.356: 64.52,6.6 L1.5 60.33,6.6 60.33,6.35 | 60.33,6.35 60.45,6.35 | 60.45,6.35 62.23,6.35 62.23,5.21 61.98,5.21 61.98,6.22 61.72,6.22 61.72,5.21 61.59,5.21 61.47,5.08 61.47,6.22 61.21,6.22 61.21,5.08 60.96,5.08 60.96,6.22 60.71,6.22 60.71,5.08 60.45,5.08 60.45,6.35 | 60.33,6.35 60.2,6.35 60.2,5.08
  Top 0.406: Q1.2 27.11,51.88 v27.05,51.94 | Q3.2 15.17,51.88 v15.11,51.94 | Q5.2 3.87,51.88 v3.43,52.7 | Q6.2 5.16,32.5 v5.14,32 | Q4.2 16.27,33.13 v15.24,33.15 | Q2.2 28.21,33.13 v27.18,33.15 | U10.GND 14.11,16.59 v14.11,15.98 | U6.1 C30.1 70.57,31.37 BT2.NEG | C31.- 66.98,35.09 BT2.NEG | C11.P$2 v61.98,30.86 | BT2.NEG 71.57,32.36 C15.1 C14.1 C13.1 71.5,38.93 D16.2 | D10.A 46.61,49.91 46.1,50.42 v46.1,53.47 46.1,53.59 46.74,54.23 D12.A | v54.48,42.8 C32.2 | v54.48,42.8 | D2.2 54.06,42.38 v54.48,42.8 | D15.A 67.94,24.13 v67.31,23.49
  other vias: 58.67,8 56.9,8 54.99,8 54.99,6.35 56.64,6.35 58.42,6.35 60.48,8.07 59.82,7.24 59.82,6.1 59.82,4.83 61.34,4.83 62.74,4.83 62.74,3.3 61.34,3.3 59.82,3.3 58.55,3.3 56.64,3.3 58.42,4.83 56.64,4.83 54.99,4.83 54.99,3.3 64.22,8.07 65.35,7.5 64.4,6.65 63.25,10.8 11.61,18.48 12.81,18.48 15.31,18.48 14.11,18.48 14.11,17.18 12.81,14.78 11.61,14.78 12.81,15.98 11.61,15.98 12.81,17.18 11.62,17.19 15.31,17.18 15.31,15.98 15.31,14.78 14.11,14.78
  pour Route2: 0,55.88 76.2,55.88 76.2,40.64 73.28,40.64 73.28,7.11 65.66,7.11 64.14,6.1 63.12,6.1 63.12,0 30.1,0 30.1,11.68 6.73,11.68 6.73,17.78 0,17.78
  pour Top (isolate 0.356): 65.66,8.38 54.61,8.38 54.61,2.54 63.12,2.54 63.12,5.21 62.36,5.21 62.36,6.35 64.52,6.35 65.66,7.11
GR
  Top 0.152: R7.1 17.46,28.81 17.46,28.19 18.35,27.3 26.04,27.3 28.63,24.71 U11.10
GS
  Top 0.152: R8.1 20.38,28.81 20.38,28.32 21.02,27.69 26.16,27.69 28.49,25.36 U11.9
I2C_SCL  (via drill 0.3)
  Top 0.152: U1.18 65.26,10.56 65.41,10.41 66.17,10.41 v66.8,9.78 | U11.15 31.31,21.09 30.61,20.38 30.61,19.68 30.35,19.43 | 20.7,18.41 19.05,16.76 19.05,16.38 18.65,15.99 U10.5 | R20.P$2 55.21,11.85 56.01,11.05 v56.01,9.91 | U3.6 15.99,3.95 15.49,4.45 15.49,6.6 16,7.11 22.61,7.11 | 22.61,7.11 23.88,8.38 | U2.B2 22.02,6.53 22.61,7.11 | U4.6 30.99,18.8 30.35,19.43 | 30.35,19.43 v29.21,19.43
  Top 0.254: 18.16,22.99 19.94,22.99 20.32,22.61 20.32,18.8 20.7,18.41 20.95,18.16 22.35,18.16 23.11,17.4 v23.11,16.38 23.11,13.27 21.91,12.07 21.91,10.35 23.88,8.38 36.07,8.38 36.96,9.27 53.21,9.27 53.85,9.91 v56.01,9.91 | 18.16,22.99 9.53,22.99 8.89,23.62 TP10.P$1 | U5.6 18.16,22.99 | U8.3 27.62,18.42 28.64,19.43 v29.21,19.43
  Bottom 0.152: 23.11,16.51 v23.11,16.38
  Bottom 0.254: v66.8,9.78 66.04,8.76 56.9,8.76 v56.01,9.91 55.12,8.89 54.36,8.89 53.21,7.75 53.21,4.95 TP8.P$1 | v29.21,19.43 26.04,19.43 23.11,16.51
I2C_SDA  (via drill 0.3)
  Top 0.152: U10.11 16.92,18.39 17.74,19.21 19.27,19.21 v19.43,19.05 | U1.17 65.5,10.06 v65.79,9.78 | 53.85,10.67 R19.P$2 | U3.1 20.59,3.95 v20.7,4.06 | U2.B1 23.06,5.79 v23.62,6.35 | U4.5 v32.13,20.89 31.96,21.06 U11.16
  Top 0.254: TP9.P$1 11.43,24.64 11.81,24.26 18.16,24.26 | 18.16,24.26 20.45,24.26 20.95,23.75 20.95,19.43 v21.34,19.05 22.86,19.05 24,17.91 v24,15.62 24,12.89 22.86,11.75 22.86,11.05 v24.38,9.53 24.89,9.02 35.69,9.02 36.58,9.91 52.96,9.78 53.85,10.67 v54.99,10.67 | U5.5 18.16,24.26 | U8.1 29.52,18.09 30.42,18.1 v30.48,18.1
  Bottom 0.152: v19.43,19.05 v21.34,19.05 | v20.7,4.06 20.19,4.57 20.19,5.84 20.7,6.35 v23.62,6.35 24.38,7.11 v24.38,9.53 | 30.48,18.67 30.48,19.18 v32.13,20.89
  Bottom 0.254: v65.79,9.78 65.41,9.27 57.78,9.27 56.39,10.67 v54.99,10.67 52.2,7.87 52.2,6.1 50.55,4.45 50.29,4.45 TP7.P$1 | v30.48,18.1 30.48,18.67 26.8,18.67 v24,15.62
N$1
  Top 0.152: R4.2 R10.2 33.92,31.61 33.66,31.88 30.99,31.88 28.45,34.42 28.45,34.88 Q2.1
N$2
  Top 0.178: U1.13 62.61,7.93 L1.3
N$3
  Top 0.3: L1.1 63.52,5.95 65.66,3.81 A1.FEED
N$4
  Top 0.152: U1.1 59.34,13.56 59.31,13.59 59.31,14.1 59.06,14.35 59.06,15.62 58.55,16.13 58.55,16.26 57.91,16.89 57.33,16.89 X1.1 57.24,17.34 C2.P$2
N$5
  Top 0.152: 62.1,14.09 U1.29 62.11,16 61.59,16.51 61.59,17.39 C6.P$2
N$6
  Top 0.152: U1.5 58.31,11.56 C3.P$1
N$7
  Top 0.152: U1.2 59.81,13.08 59.18,13.08 58.93,13.34 58.93,13.84 58.17,14.73 55.88,14.73 55.21,15.4 X1.3 55.16,15.66 C1.P$2
N$8
  Top 0.152: U11.13 29.32,22.58 29.21,22.48 29.21,21.61 R16.2
N$9
  Top 0.152: U10.37 11.27,13.6 9.06,13.6 8.93,13.47 8.93,12.81 X2.1 8.72,12.88 7.95,12.36 7.95,10.41 C16.1
N$10
  Top 0.152: U1.21 65.41,12.06 65.91,11.56 67.22,11.56 C9.P$2
N$12
  Top 0.152: 11.7,13.55 U10.38 11.69,12.39 11.24,11.94 11.24,11.34 C17.1 11.19,11.42 10.06,11.42 X2.3
N$13
  Top 0.178: U1.12 62.11,7.93 L1.4
N$14
  Top 0.152: D1.N 64.52,17.78 64.14,17.4 63.23,17.4 R2.P$2
N$16
  Top 0.406: D3.A Q1.3 30.44,50.95 K3_W.7
N$18
  Top 0.406: K3_W.12 30.44,35.92 Q2.3 D4.A
N$20
  Top 0.152: Q4.1 16.51,34.75 16.51,34.42 18.67,32.26 22.61,32.26 22.99,31.88 27.56,31.88 27.83,31.61 R12.2 R6.2
N$21  (via drill 0.3)
  Top 0.152: v28.96,54.74 28.57,54.74 28.32,54.48 28.32,54.15 Q1.1 | R3.2 v30.88,29.84 R9.2
  Bottom 0.152: v28.96,54.74 29.34,54.74 29.59,54.48 29.59,44.07 28.45,42.93 28.45,32.51 28.96,32 30.48,32 30.88,31.61 v30.88,29.84
N$22
  Top 0.406: D5.A Q3.3 18.5,50.95 K2_Y.7
N$23  (via drill 0.3)
  Top 0.152: Q3.1 16.38,53.78 16.38,54.48 16.64,54.74 v17.02,54.74 | R5.2 v24.78,29.84 | v24.78,29.84 R11.2 24.45,30.86 | v24.78,29.84 v24.77,29.84
  Bottom 0.152: v17.02,54.74 17.4,54.74 17.65,54.48 17.65,43.94 18.16,43.43 24.13,43.43 24.77,42.8 v24.77,29.84
N$24
  Top 0.406: K2_Y.12 18.5,35.92 Q4.3 D6.A
N$25
  Top 0.152: Q6.1 4.57,34.75 4.57,34.42 7.81,31.18 15.3,31.18 16,31.88 21.4,31.88 21.67,31.61 R14.2 R8.2
N$26
  Top 0.406: D7.A Q5.3 6.56,50.95 K1_G.7
N$27  (via drill 0.3)
  Top 0.152: Q5.1 4.45,53.78 4.45,54.48 4.7,54.74 v5.08,54.74 | R7.2 v18.68,29.84 R13.2
  Bottom 0.152: v5.08,54.74 5.46,54.74 5.71,54.48 5.71,41.91 6.73,40.89 14.22,40.89 16.51,38.99 16.51,31.75 17.4,30.86 18.03,30.86 18.68,30.21 v18.68,29.84
N$28
  Top 0.406: D8.A Q6.3 6.56,35.92 K1_G.12
N$29
  Top 0.152: U10.29 8.86,17.19 C18.1
N$30
  Top 0.152: 18.27,11.57 X3.A | 18.04,11.63 X3.A | C20.1 18.16,10.77 X3.A | U10.45 14.49,12.95 15.69,11.63 18.02,11.63 X3.A
N$31
  Top 0.152: U10.46 14.89,13.64 14.89,13.04 15.46,12.48 15.76,12.48 17.91,12.47 C21.1 18.34,12.41 X3.B
N$32
  Top 0.152: U10.39 12.09,11.49 12.19,11.4 C19.1
N$33
  Top 0.152: L4.ANT1 7.23,16.4 10.65,16.4 U10.31
N$34
  Top 0.152: U10.32 7.26,15.99 L4.ANT2
N$35
  Top 0.152: U10.30 10.64,16.81 7.36,16.81 7.15,17.02 C22.1 6.56,16.96 L4.VCC
N$36
  Top 0.152: U10.36 U10.35 9.62,14.79 C24.1 8.52,14.58 C27.1 | C27.1 8.45,14.58 | L2.1 7.85,13.56 8.32,14.03 C27.1
N$37
  Top 0.152: L2.2 7.2,14.43 6.96,14.2 6.96,12.97 L3.1
N$38  (via drill 0.3)
  Top 0.152: U10.2 17.3,14.79 v17.5,14.5 | 6.92,11.13 L3.2 7.02,10.89 v6.67,10.54
  Bottom 0.152: v6.67,10.54 6.67,10.98 7.43,11.75 11.05,11.75 12.32,13.02 16.02,13.02 v17.5,14.5
N$42
  Top 0.406: D14.A 62.94,29.04 U6.2 C30.2
N$43
  Top 0.406: D13.C 68.12,26.84 U6.3 65.62,26.37 R1.P$2
N$44
  Top 0.406: BT1.POS 38.39,11.72 39.5,12.83 39.5,16.45 45.08,22.03 65.98,22.03 66.55,21.46 75.31,21.46 76.07,22.22 76.07,24.13 | 76.07,28.08 D13.A 73.66,28.06 | BT2.POS 70.64,44.22 71.5,45.09 74.17,45.09 76.14,43.18 76.07,28.08 | 76.07,24.13 76.07,28.08 | D15.C 76.07,24.13
N$46
  Top 0.152: 36.45,14.84 X4.A 36.97,14.58 C28.1 U4.1
N$47
  Top 0.152: 35.56,14.47 C29.1 | C29.1 35.72,14.47 | C29.1 35.76,14.47 36.2,14.03 36.28,14.03 X4.B | C29.1 35.69,17.08 36.2,17.59 U4.2
N$50
  Top 0.406: K2_Y.4 25.27,44.7 26.42,43.56 26.42,40.58 26.99,40.01 38.61,40.01 40.26,38.35 R17.P$2
N$51
  Top 0.406: K3_W.4 36.13,44.58 37.97,44.58 38.99,43.56 38.99,41.08 40.39,39.69 R18.P$2
OOB  (via drill 0.3)
  Top 0.152: v66.8,16.64 65.15,14.99 64.39,14.99 64.14,14.73 64.14,14.1 64.12,14.1 U1.25 | U$1.6 75.89,17.96 v74.55,19.18
  Bottom 0.152: v74.55,19.18 69.34,19.18 v66.8,16.64
PIRSIG  (via drill 0.3)
  Top 0.152: U1.7 59.42,10.56 58.8,11.18 57.91,11.18 57.66,11.43 56.39,11.43 56.13,11.68 56.13,13.34 55.25,14.22 51.94,14.22 50.55,15.62 50.55,19.3 v50.29,19.56 | U10.9 18.48,17.59 v18.67,17.78
  Bottom 0.152: 44.2,23.11 46.74,23.11 v50.29,19.56 | 44.2,23.11 26.54,23.11 21.21,17.78 v18.67,17.78 18.67,19.68 17.53,20.83 14.61,20.83 13.08,22.35 13.08,24.51 TP16.P$1 | U7.OUT 44.2,23.11
R  (via drill 0.61)
  Top 0.406: K1_G.4 K2_Y.9 19.18,44.7 20.32,43.56 20.32,41.15 22.86,38.61 v32.26,38.61 37.91,38.61 39.05,37.46 42.42,37.46 | v32.26,43.43 30.99,44.7 K3_W.9 | v55.5,48.39 54.36,48.39 53.72,49.02 53.72,50.03 D9.A D10.C 50.55,48.78 50.55,42.16 45.85,37.46 42.42,37.46 | 42.42,37.46 R17.P$1 R18.P$1
  Bottom 0.406: J2.P$2 81.23,45.8 80.01,44.58 | 80.01,44.58 73.03,44.58 69.22,48.39 v55.5,48.39 | J2.P$3 81.28,43.31 80.01,44.58 | v32.26,38.61 v32.26,43.43
SPI_MISO  (via drill 0.3)
  Top 0.152: U10.48 15.84,13.59 15.94,13.49 20.32,13.49 20.6,13.21 v21.08,13.21 | 61.09,9.28 U1.10 | v50.29,11.56 50.29,12.07 49.02,13.34 49.02,18.16 v46.86,20.32
  Top 0.254: U1.10 61.11,8.91 60.96,8.76 54.23,8.76 53.21,7.75 45.47,7.75 TP21.P$1
  Bottom 0.152: v21.08,13.21 22.23,14.35 22.23,16.76 27.05,21.59 43.56,21.59 45.34,19.81 46.23,19.81 46.74,20.32 v46.86,20.32 | TP21.P$1 45.47,7.75 46.86,7.75 48.01,8.89 48.64,8.89 50.29,10.54 v50.29,11.56
SPI_MOSI  (via drill 0.3)
  Top 0.152: v20.32,15.37 20.14,15.19 U10.3 | v49.4,10.8 49.4,12.07 48.51,12.95 48.51,17.78 v45.72,20.57
  Top 0.254: U1.9 60.21,9.41 60.07,9.27 53.97,9.27 52.96,8.25 43.56,8.25 TP20.P$1
  Bottom 0.152: 20.95,15.37 v20.32,15.37 21.59,15.37 21.84,15.62 21.84,16.89 26.92,21.97 45.08,21.97 45.72,21.34 v45.72,20.57 | TP20.P$1 43.56,8.25 46.48,8.25 47.75,9.53 48.13,9.53 v49.4,10.8
SPI_SCK  (via drill 0.3)
  Top 0.152: U10.4 16.65,15.6 16.8,15.6 18.28,15.6 18.9,15.6 v19.94,16.64 | U1.16 64.77,9.41 64.77,9.14 68.45,9.14 68.71,9.4 68.71,10.16 68.33,10.54 68.33,12.83 68.83,13.34 68.83,17.02 65.02,20.19 49.53,20.19 v49.15,19.81 50.04,18.92 50.04,14.1 52.07,12.19 v52.07,11.56
  Bottom 0.152: TP23.P$1 49.4,7.62 52.07,10.41 v52.07,11.56 | v19.94,16.64 20.57,17.27 21.21,17.27 26.67,22.73 46.61,22.73 49.15,20.19 v49.15,19.81
SS  (via drill 0.3)
  Top 0.152: U1.15 63.63,9.41 63.63,8.76 68.71,8.76 69.09,9.14 69.09,10.41 68.71,10.8 68.71,12.57 69.22,13.08 69.22,17.27 65.28,20.57 48.51,20.57 v48.01,20.07 49.53,18.54 49.53,13.72 51.18,12.07 v51.18,10.8 | U10.47 15.29,13.16 15.62,12.83 16.51,12.83 16.76,13.08 20.19,13.08 20.83,12.45 21.34,12.45 21.84,12.95 21.84,15.49 v21.08,16.13
  Bottom 0.152: v21.08,16.13 21.08,16.64 26.8,22.35 46.48,22.35 48.01,20.83 v48.01,20.07 | TP22.P$1 48.64,8.25 49.02,8.25 51.18,10.54 v51.18,10.8
SWCLK  (via drill 0.3)
  Top 0.152: v70.23,14.86 70.61,15.24 72.64,15.24 73.15,15.75 75.18,15.75 76.13,16.7 U$1.4 | U1.31 61.09,14.1 61.09,15.37 v60.96,15.49
  Bottom 0.152: v70.23,14.86 69.85,14.48 62.1,14.48 v60.96,15.49
SWDCLK  (via drill 0.3)
  Top 0.152: U10.24 11.29,19.97 11.27,19.98 10.76,19.98 R15.2 | R15.2 10.74,20.05 | J1.4 5.67,19.26 v5.02,18.61 | v9.84,20.76 9.84,20.32 10.1,20.07 10.7,20.07 R15.2
  Bottom 0.152: v5.02,18.61 5.02,20.13 6.1,21.21 9.4,21.21 v9.84,20.76
SWDIO  (via drill 0.3)
  Top 0.152: U$1.2 76.14,15.69 75.82,15.37 v75.82,12.95 | U1.32 60.61,14.7 60.2,15.11 v60.07,15.11
  Bottom 0.152: v60.07,15.11 60.33,15.11 61.59,13.84 68.07,13.84 68.33,14.1 70.74,14.1 71.25,13.72 72.26,13.72 73.53,12.45 75.31,12.45 v75.82,12.95
SWDIO/!RESET
  Top 0.152: J1.2 7.32,19.05 8.51,19.05 9.14,19.68 9.14,22.16 9.46,22.48 11.18,22.48 11.69,21.96 U10.23
W  (via drill 0.61)
  Top 0.406: K3_W.8 32.39,47.24 v33.53,46.1
  Bottom 0.406: J2.P$4 75.83,35.8 64.64,46.99 54.61,46.99 49.53,52.07 39.5,52.07 v33.53,46.1
WR
  Top 0.152: U11.5 31.96,27.35 31.24,28.07 29.84,28.07 29.59,28.32 29.59,28.81 R3.1
WS
  Top 0.152: U11.4 32.79,28.49 32.77,28.7 32.7,28.81 R4.1
Y  (via drill 0.61)
  Top 0.406: K2_Y.8 19.18,47.24 20.32,46.1 v31.37,46.1
  Bottom 0.406: v31.37,46.1 32.89,44.58 34.16,44.58 35.05,45.47 35.05,46.1 39.75,50.8 49.15,50.8 54.23,45.72 64.01,45.72 78.93,30.8 J2.P$5
YR
  Top 0.152: R5.1 23.48,28.34 23.75,28.07 26.29,28.07 28.17,26.18 U11.8
YS
  Top 0.152: R6.1 26.46,28.46 28.19,26.8 30.35,26.8 30.66,26.49 U11.7

### Text on the board
tPlace: D1 | NUCLEUM | J ADKINS | E BURGER | M ANDERSEN | HAMILTON (3/7)C | (C) 2017 | UC BERKELEY
bPlace: HAMILTON / THERMOSTAT
tNames: C | R | RC | W | Y | G | X1 | U1